# EAGLE design BMS_Slave_v2 (EAGLE 6.4)
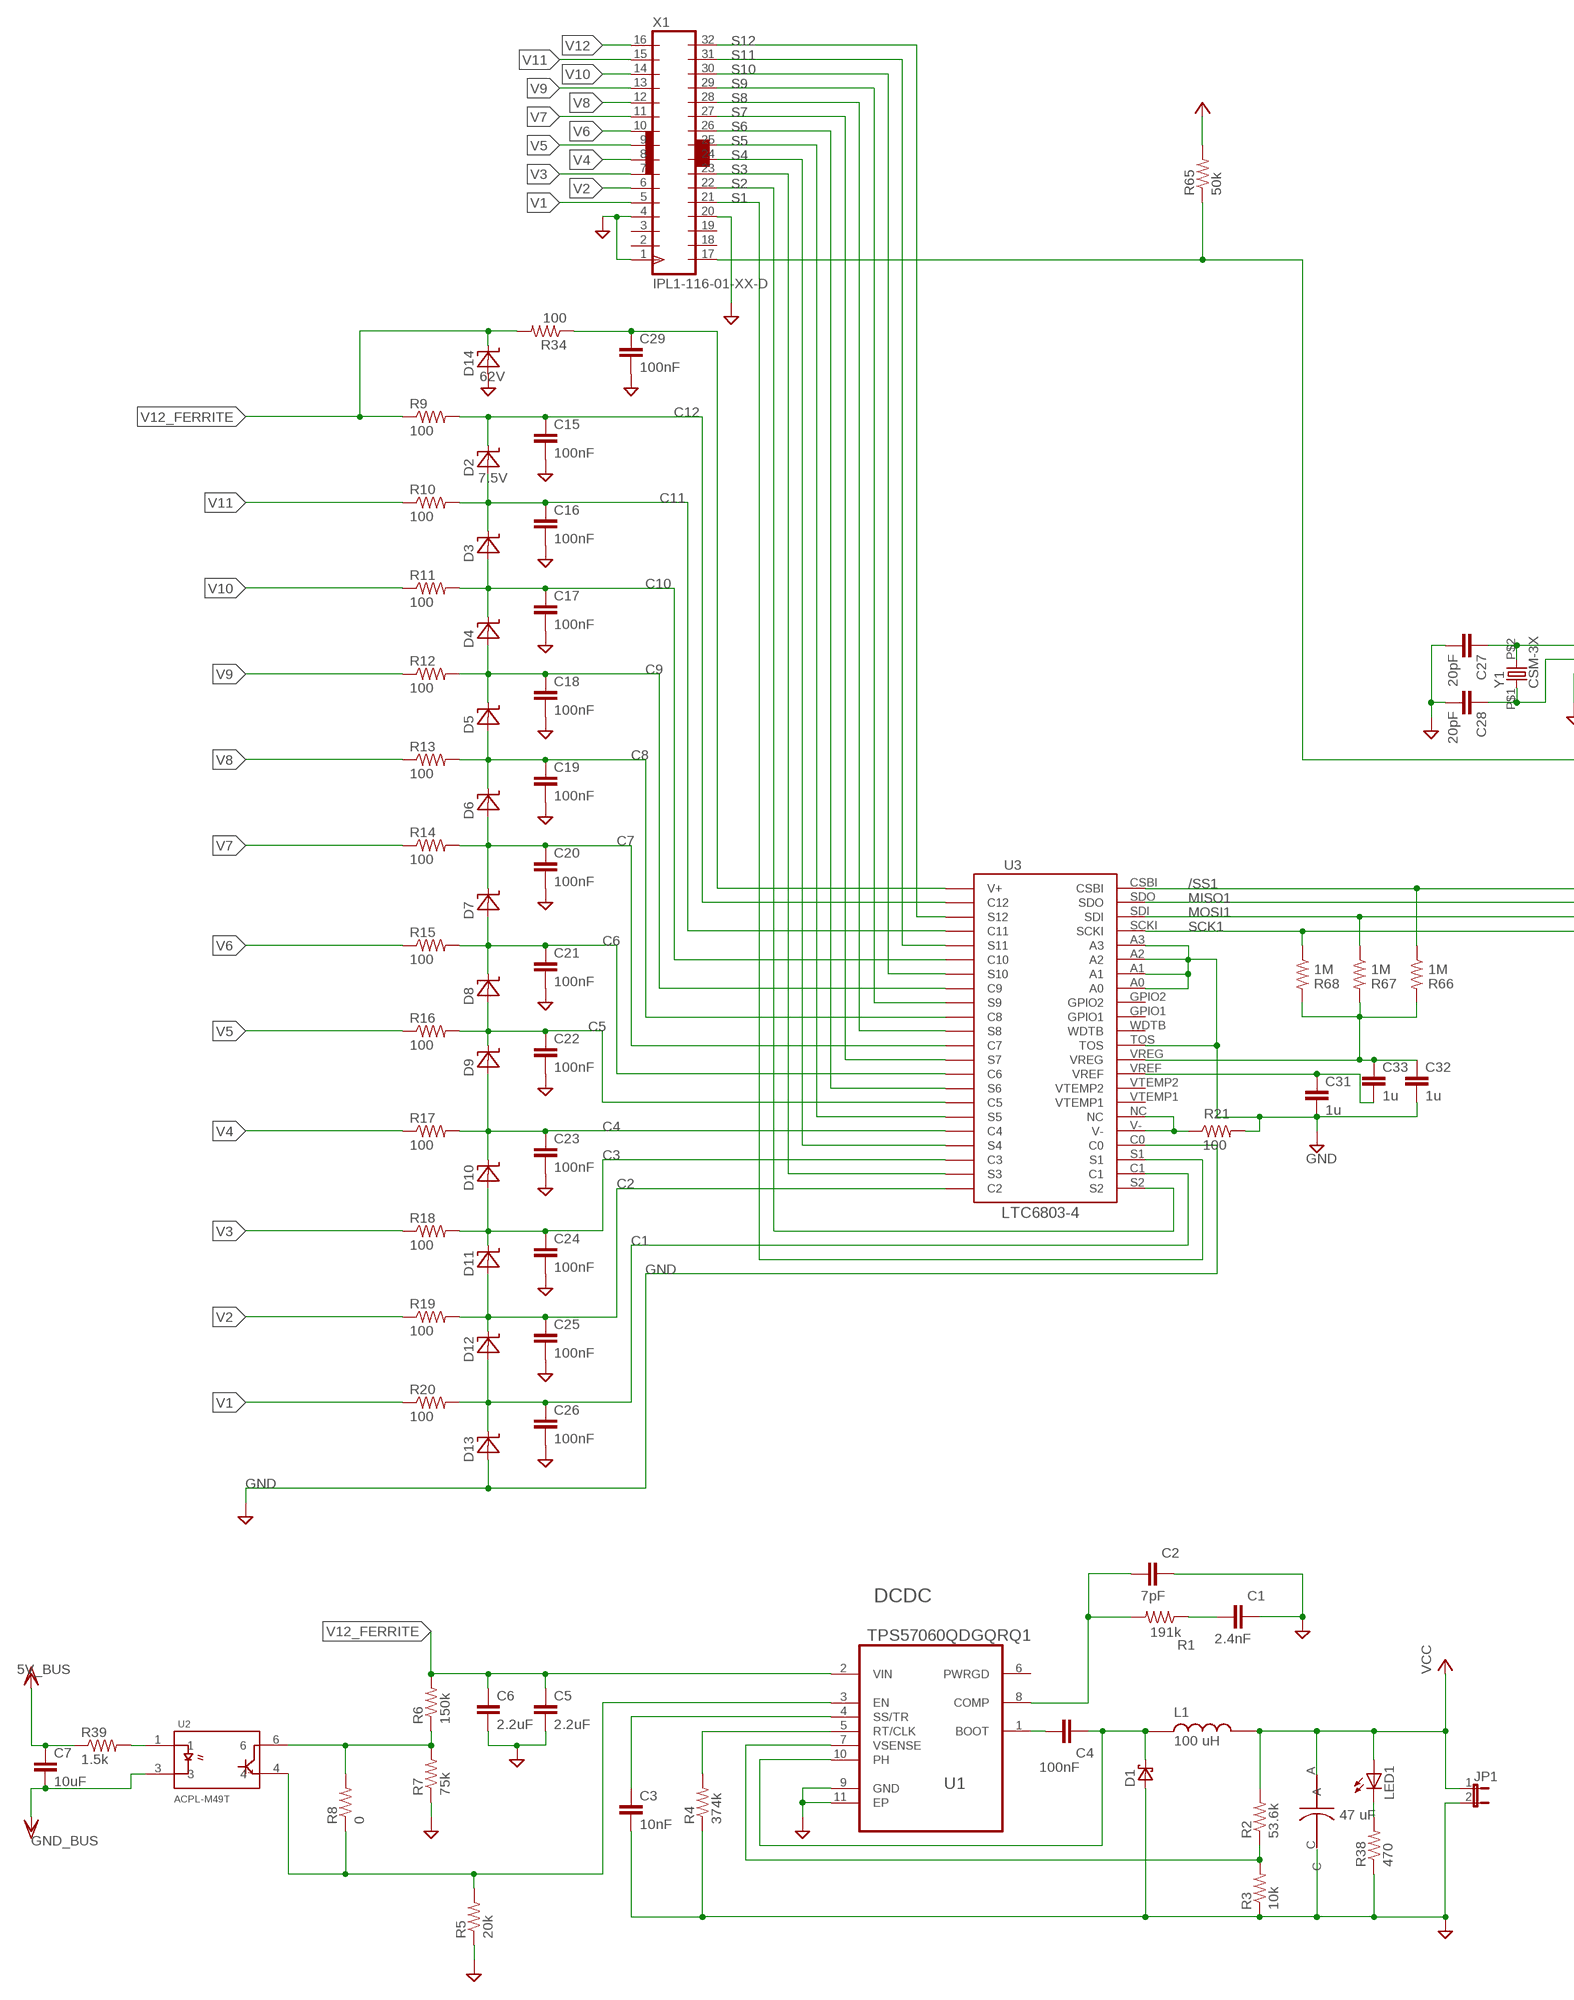
[diagram p0: schematic, sheet 1, part 1 of 2]
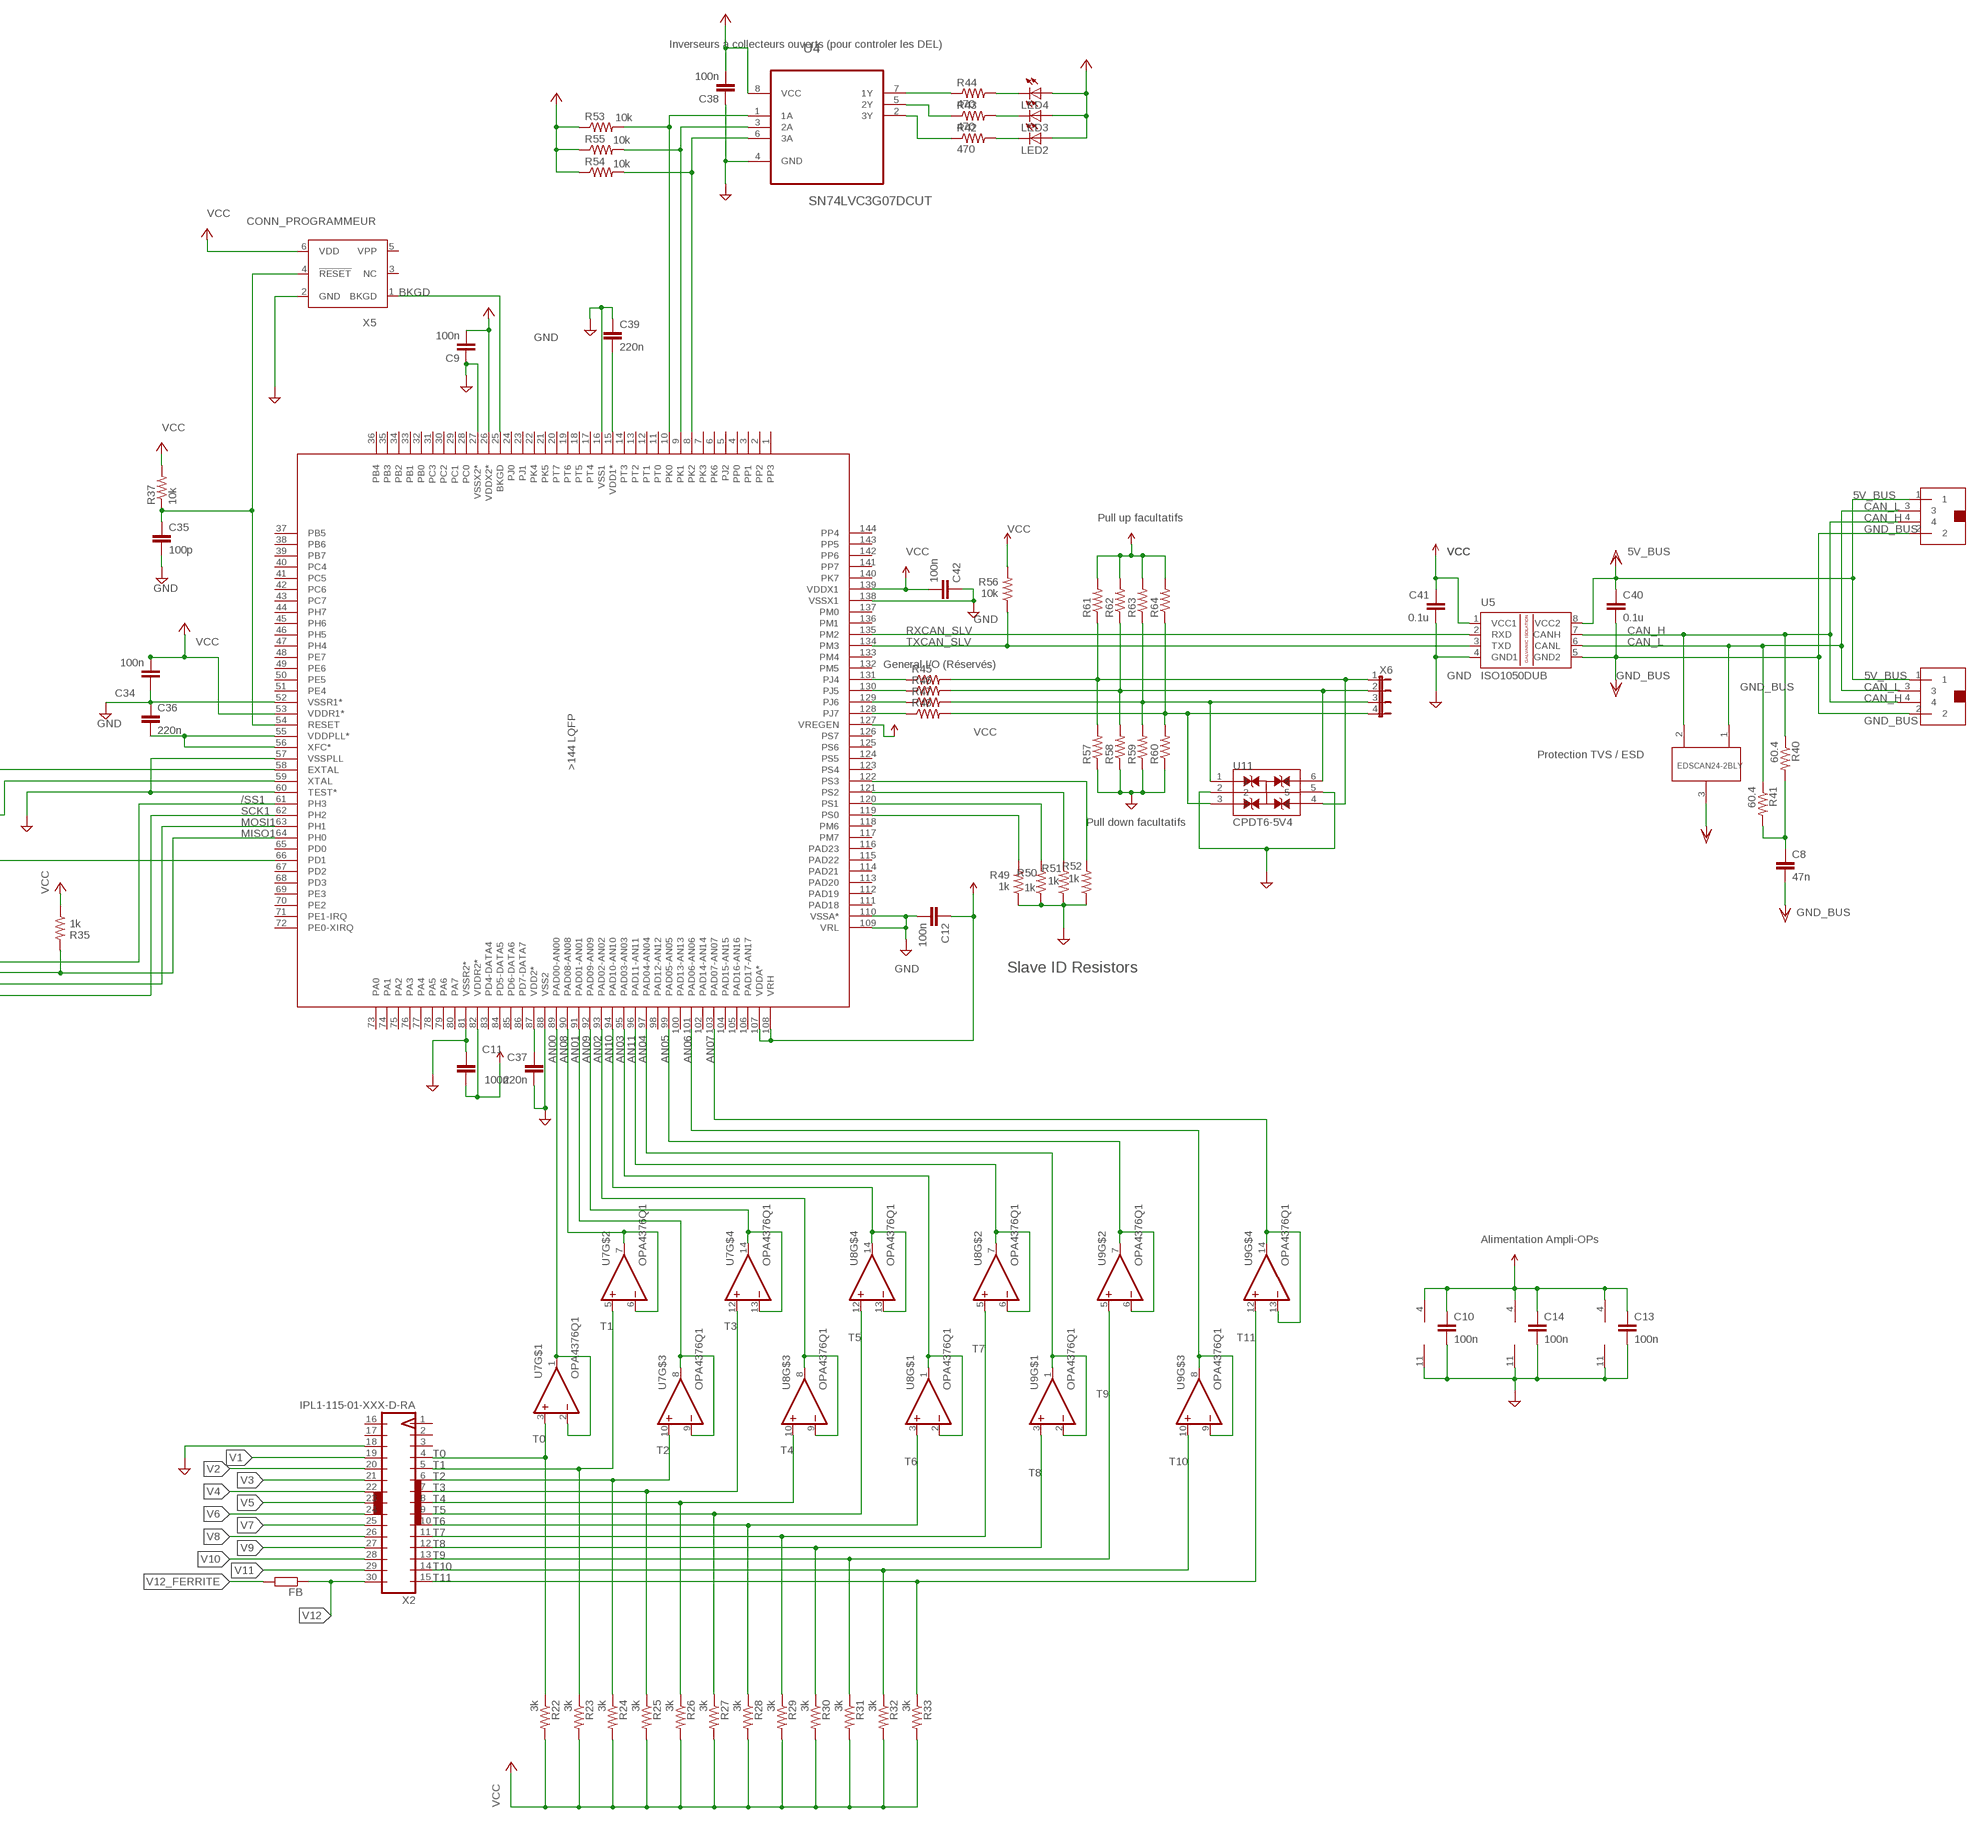
[diagram p1: schematic, sheet 1, part 2 of 2]

## Parts
C1  2.4nF  CC0603  [C0603]
C2  7pF  CC0603  [C0603]
C3  10nF  CC0603  [C0603]
C4  100nF  CC0603  [C0603]
C5  2.2uF  C-EUC3225  [C3225]
C6  2.2uF  C-EUC3225  [C3225]
C7  10uF  CC0603  [C0603]
C8  47n  C-EUC0603  [C0603]
C9  100n  C-EUC0603  [C0603]
C10  100n  C-EUC0603  [C0603]
C11  100n  CC0603  [C0603]
C12  100n  C-EUC0603  [C0603]
C13  100n  C-EUC0603  [C0603]
C14  100n  C-EUC0603  [C0603]
C15  100nF  CC0603  [C0603]
C16  100nF  CC0603  [C0603]
C17  100nF  CC0603  [C0603]
C18  100nF  CC0603  [C0603]
C19  100nF  CC0603  [C0603]
C20  100nF  CC0603  [C0603]
C21  100nF  CC0603  [C0603]
C22  100nF  CC0603  [C0603]
C23  100nF  CC0603  [C0603]
C24  100nF  CC0603  [C0603]
C25  100nF  CC0603  [C0603]
C26  100nF  CC0603  [C0603]
C27  20pF  C-EUC0603  [C0603]
C28  20pF  C-EUC0603  [C0603]
C29  100nF  CC0603  [C0603]
C31  1u  CC0603  [C0603]
C32  1u  CC0603  [C0603]
C33  1u  CC0603  [C0603]
C34  100n  CC0603  [C0603]
C35  100p  CC0603  [C0603]
C36  220n  CC0603  [C0603]
C37  220n  C-EUC0603  [C0603]
C38  100n  C-EUC0603  [C0603]
C39  220n  C-EUC0603  [C0603]
C40  0.1u  C-EUC0603  [C0603]
C41  0.1u  C-EUC0603  [C0603]
C42  100n  C-EUC0603  [C0603]
C43  47 uF  APXE_47_COND  [APXE_CONDENSATEUR]
D1  BYS12-90GENERIC  [DO214AC_ZENER]
D2  DIODE_ZENER  [SOD123]
D3  DIODE_ZENER  [SOD123]
D4  DIODE_ZENER  [SOD123]
D5  DIODE_ZENER  [SOD123]
D6  DIODE_ZENER  [SOD123]
D7  DIODE_ZENER  [SOD123]
D8  DIODE_ZENER  [SOD123]
D9  DIODE_ZENER  [SOD123]
D10  DIODE_ZENER  [SOD123]
D11  DIODE_ZENER  [SOD123]
D12  DIODE_ZENER  [SOD123]
D13  DIODE_ZENER  [SOD123]
D14  DIODE_ZENER  [SOD123]
FB  R-EU_R0805  [R0805]
JP1  JP1E  [JP1]
L1  100 uH  VLP8040T-101M  [VLP8040T-101M]
LED1  LED  [1206_LED]
LED2  LED  [1206_LED]
LED3  LED  [1206_LED]
LED4  LED  [1206_LED]
R1  191k  R-US_R0603  [R0603]
R2  53.6k  R-US_R0603  [R0603]
R3  10k  R-US_R0603  [R0603]
R4  374k  R-US_R0603  [R0603]
R5  20k  R-US_R0603  [R0603]
R6  150k  R-US_R0603  [R0603]
R7  75k  R-US_R0603  [R0603]
R8  0  R-US_R0603  [R0603]
R9  100  R-US_R0603  [R0603]
R10  100  R-US_R0603  [R0603]
R11  100  R-US_R0603  [R0603]
R12  100  R-US_R0603  [R0603]
R13  100  R-US_R0603  [R0603]
R14  100  R-US_R0603  [R0603]
R15  100  R-US_R0603  [R0603]
R16  100  R-US_R0603  [R0603]
R17  100  R-US_R0603  [R0603]
R18  100  R-US_R0603  [R0603]
R19  100  R-US_R0603  [R0603]
R20  100  R-US_R0603  [R0603]
R21  100  R-US_R0603  [R0603]
R22  3k  R-US_R0603  [R0603]
R23  3k  R-US_R0603  [R0603]
R24  3k  R-US_R0603  [R0603]
R25  3k  R-US_R0603  [R0603]
R26  3k  R-US_R0603  [R0603]
R27  3k  R-US_R0603  [R0603]
R28  3k  R-US_R0603  [R0603]
R29  3k  R-US_R0603  [R0603]
R30  3k  R-US_R0603  [R0603]
R31  3k  R-US_R0603  [R0603]
R32  3k  R-US_R0603  [R0603]
R33  3k  R-US_R0603  [R0603]
R34  100  R-US_R0603  [R0603]
R35  1k  R-US_R0603  [R0603]
R37  10k  R-US_R0603  [R0603]
R38  470  R-US_R0603  [R0603]
R39  1.5k  R-US_R0603  [R0603]
R40  60.4  R-US_R0603  [R0603]
R41  60.4  R-US_R0603  [R0603]
R42  470  R-US_R0603  [R0603]
R43  470  R-US_R0603  [R0603]
R44  470  R-US_R0603  [R0603]
R45  R-US_R0603  [R0603]
R46  R-US_R0603  [R0603]
R47  R-US_R0603  [R0603]
R48  R-US_R0603  [R0603]
R49  1k  R-US_R0603  [R0603]
R50  1k  R-US_R0603  [R0603]
R51  1k  R-US_R0603  [R0603]
R52  1k  R-US_R0603  [R0603]
R53  10k  R-US_R0603  [R0603]
R54  10k  R-US_R0603  [R0603]
R55  10k  R-US_R0603  [R0603]
R56  10k  R-US_R0603  [R0603]
R57  R-US_R0603  [R0603]
R58  R-US_R0603  [R0603]
R59  R-US_R0603  [R0603]
R60  R-US_R0603  [R0603]
R61  R-US_R0603  [R0603]
R62  R-US_R0603  [R0603]
R63  R-US_R0603  [R0603]
R64  R-US_R0603  [R0603]
R65  50k  R-US_R0603  [R0603]
R66  1M  R-US_R0603  [R0603]
R67  1M  R-US_R0603  [R0603]
R68  1M  R-US_R0603  [R0603]
U1  TPS57060QDGQRQ1  TPS54060QDGQRQ1  [SOP50P490X110-11N]
U2  ACPL-M49T  [SO5]
U3  LTC6803-4  [LTC6803-4]
U4  SN74LVC3G07DCUT  [SOP50P310X90-8N]
U5  ISO1050DUB  [DUB-R-PDSO-G8]
U6  MC9S12XD-144  [SQFP-S-20X20-144]
U7  OPA4376Q1  [TSSOP-14]
U8  OPA4376Q1  [TSSOP-14]
U9  OPA4376Q1  [TSSOP-14]
U10  EDSCAN24-2BLY  [SOT23-3]
U11  CPDT6-5V4  [SOT23-6]
X1  IPL1-116-01-XX-D  [IPL1-116-01-XX-D]
X2  IPL1-115-01-XXX-D-RA  [IPL1-115-01-XXX-D-RA]
X3  IPL1-102-01-XXX-D-RA  [IPL1-102-01-XXX-D-RA]
X4  IPL1-102-01-XXX-D-RA  [IPL1-102-01-XXX-D-RA]
X5  CONN_PROGRAMMEUR  [CONNECTEUR_PROGRAMMEUR]
X6  JP4E  [JP4]
Y1  CSM-3X  [CSM-3X]

## Nets
1: C2.1 R1.2 U1.8(COMP)
5V_BUS: C7.1 C40.1 R39.1 U5.8(VCC2) X3.1 X4.1
/SS1: R66.1 U3.CSBI U6.61(PH3)
AN00: U6.89(PAD00-AN00) U7.1(OUT) U7.2(-IN)
AN01: U6.91(PAD01-AN01) U7.8(OUT) U7.9(-IN)
AN02: U6.93(PAD02-AN02) U8.8(OUT) U8.9(-IN)
AN03: U6.95(PAD03-AN03) U8.1(OUT) U8.2(-IN)
AN04: U6.97(PAD04-AN04) U9.1(OUT) U9.2(-IN)
AN05: U6.99(PAD05-AN05) U9.6(-IN) U9.7(OUT)
AN06: U6.101(PAD06-AN06) U9.8(OUT) U9.9(-IN)
AN07: U6.103(PAD07-AN07) U9.13(-IN) U9.14(OUT)
AN08: U6.90(PAD08-AN08) U7.6(-IN) U7.7(OUT)
AN09: U6.92(PAD09-AN09) U7.13(-IN) U7.14(OUT)
AN10: U6.94(PAD10-AN10) U8.13(-IN) U8.14(OUT)
AN11: U6.96(PAD11-AN11) U8.6(-IN) U8.7(OUT)
BKGD: U6.25(BKGD) X5.1(BKGD)
C1: C26.1 D12.A D13.C R20.2 U3.C1
C2: C25.1 D11.A D12.C R19.2 U3.C2
C3: C24.1 D10.A D11.C R18.2 U3.C3
C4: C23.1 D9.A D10.C R17.2 U3.C4
C5: C22.1 D8.A D9.C R16.2 U3.C5
C6: C21.1 D7.A D8.C R15.2 U3.C6
C7: C20.1 D6.A D7.C R14.2 U3.C7
C8: C19.1 D5.A D6.C R13.2 U3.C8
C9: C18.1 D4.A D5.C R12.2 U3.C9
C10: C17.1 D3.A D4.C R11.2 U3.C10
C11: C16.1 D2.A D3.C R10.2 U3.C11
C12: C15.1 D2.C R9.2 U3.C12
C44: C4.2 D1.C L1.P$2 U1.10(PH)
CAN_H: R40.1 U5.7(CANH) U10.2 X3.4 X4.4
CAN_L: R41.1 U5.6(CANL) U10.1 X3.3 X4.3
CSS: C3.1 U1.4(SS/TR)
EXTAL: C27.1 U6.58(EXTAL) Y1.P$2
GND [GND plain]: C1.2 C2.2 C3.2 C5.2 C6.2 C9.1 C10.2 C11.1 C12.2 C13.2 C14.2 C15.2 C16.2 C17.2 C18.2 C19.2 C20.2 C21.2 C22.2 C23.2 C24.2 C25.2 C26.2 C27.2 C28.2 C29.2 C31.2 C32.2 C34.1 C35.2 C36.1 C37.2 C38.1 C39.1 C41.2 C42.1 C43.C D1.A D13.A D14.A JP1.2 R3.1 R4.1 R5.1 R7.1 R21.2 R38.1 R49.1 R50.1 R51.1 R52.1 R57.1 R58.1 R59.1 R60.1 U1.9(GND) U1.11(EP) U3.A0 U3.A1 U3.A2 U3.A3 U3.C0 U3.TOS U4.4(GND) U5.4(GND1) U6.16(VSS1) U6.27(VSSX2*) U6.52(VSSR1*) U6.57(VSSPLL) U6.60(TEST*) U6.81(VSSR2*) U6.88(VSS2) U6.109(VRL) U6.110(VSSA*) U6.138(VSSX1) U7.11(V-) U8.11(V-) U9.11(V-) U11.2 U11.5 X1.1 X1.4 X1.20 X2.18 X5.2(GND) ; supply symbol labelled GND_SLV
GND_BUS [GND plain]: C7.2 C8.2 C40.2 U2.3 U5.5(GND2) U10.3 X3.2 X4.2
MISO1: R35.2 U3.SDO U6.64(PH0)
MOSI1: R67.1 U3.SDI U6.63(PH1)
N$1: C29.1 R34.1 U3.V+
N$2: R39.2 U2.1
N$3: C37.1 U6.87(VDD2*)
N$4: C31.1 C33.2 U3.VREF
N$5: C32.1 C33.1 R66.2 R67.2 R68.2 U3.VREG
N$6 [GND plain]: R21.1 U3.NC U3.V-
N$7: C36.2 U6.55(VDDPLL*) U6.56(XFC*)
N$11: R42.1 U4.2(3Y)
N$16: R49.2 U6.119(PS0)
N$17: R50.2 U6.120(PS1)
N$19: R51.2 U6.121(PS2)
N$20: R52.2 U6.122(PS3)
N$23: LED2.C R42.2
N$25: LED3.C R43.2
N$26: LED4.C R44.2
N$27: R44.1 U4.7(1Y)
N$28: R43.1 U4.5(2Y)
N$30: R65.1 U6.66(PD1) X1.17
N$31: R45.1 U6.131(PJ4)
N$32: C8.1 R40.2 R41.2
N$33: R46.1 U6.130(PJ5)
N$34: R54.2 U4.6(3A) U6.8(PK2)
N$35: R55.2 U4.3(2A) U6.9(PK1)
N$40: R53.2 U4.1(1A) U6.10(PK0)
N$42: C4.1 U1.1(BOOT)
N$43: R4.2 U1.5(RT/CLK)
N$44: R47.1 U6.129(PJ6)
N$45: R2.1 R3.2 U1.7(VSENSE)
N$47: LED1.C R38.2
N$48: R48.1 U6.128(PJ7)
N$49: R5.2 R8.1 U1.3(EN) U2.4
N$50: R6.1 R7.2 R8.2 U2.6
N$51: R45.2 R57.2 R61.1 U11.4 X6.1
N$52: R46.2 R58.2 R62.1 U11.6 X6.2
N$53: R47.2 R59.2 R63.1 U11.1 X6.3
N$54: R48.2 R60.2 R64.1 U11.3 X6.4
R59: C1.1 R1.1
RST: C35.1 R37.1 U6.54(RESET) X5.4(!RESET)
RXCAN_SLV: U5.2(RXD) U6.135(PM2)
S1: U3.S1 X1.21
S2: U3.S2 X1.22
S3: U3.S3 X1.23
S4: U3.S4 X1.24
S5: U3.S5 X1.25
S6: U3.S6 X1.26
S7: U3.S7 X1.27
S8: U3.S8 X1.28
S9: U3.S9 X1.29
S10: U3.S10 X1.30
S11: U3.S11 X1.31
S12: U3.S12 X1.32
SCK1: R68.1 U3.SCKI U6.62(PH2)
T0: R22.1 U7.3(+IN) X2.4
T1: R23.1 U7.5(+IN) X2.5
T2: R24.1 U7.10(+IN) X2.6
T3: R25.1 U7.12(+IN) X2.7
T4: R26.1 U8.10(+IN) X2.8
T5: R27.1 U8.12(+IN) X2.9
T6: R28.1 U8.3(+IN) X2.10
T7: R29.1 U8.5(+IN) X2.11
T8: R30.1 U9.3(+IN) X2.12
T9: R31.1 U9.5(+IN) X2.13
T10: R32.1 U9.10(+IN) X2.14
T11: R33.1 U9.12(+IN) X2.15
TXCAN_SLV: R56.1 U5.3(TXD) U6.134(PM3)
V1: R20.1 X1.5 X2.19
V2: R19.1 X1.6 X2.20
V3: R18.1 X1.7 X2.21
V4: R17.1 X1.8 X2.22
V5: R16.1 X1.9 X2.23
V6: R15.1 X1.10 X2.24
V7: R14.1 X1.11 X2.25
V8: R13.1 X1.12 X2.26
V9: R12.1 X1.13 X2.27
V10: R11.1 X1.14 X2.28
V11: R10.1 X1.15 X2.29
V12: FB.1 X1.16 X2.30
V12_FERRITE: C5.1 C6.1 D14.C FB.2 R6.2 R9.1 R34.2 U1.2(VIN)
VCC: C9.2 C10.1 C11.2 C12.1 C13.1 C14.1 C34.2 C38.2 C41.1 C42.2 C43.A JP1.1 L1.P$1 LED1.A LED2.A LED3.A LED4.A R2.2 R22.2 R23.2 R24.2 R25.2 R26.2 R27.2 R28.2 R29.2 R30.2 R31.2 R32.2 R33.2 R35.1 R37.2 R53.1 R54.1 R55.1 R56.2 R61.2 R62.2 R63.2 R64.2 R65.2 U4.8(VCC) U5.1(VCC1) U6.26(VDDX2*) U6.53(VDDR1*) U6.82(VDDR2*) U6.107(VDDA*) U6.108(VRH) U6.127(VREGEN) U6.139(VDDX1) U7.4(V+) U8.4(V+) U9.4(V+) X5.6(VDD)
VDD1: C39.2 U6.15(VDD1*)
XTAL: C28.1 U6.59(XTAL) Y1.P$1
Unconnected: U1.6(PWRGD) U3.GPIO1 U3.GPIO2 U3.VTEMP1 U3.VTEMP2 U3.WDTB U6.1(PP3) U6.2(PP2) U6.3(PP1) U6.4(PP0) U6.5(PJ2) U6.6(PK6) U6.7(PK3) U6.11(PT0) U6.12(PT1) U6.13(PT2) U6.14(PT3) U6.17(PT4) U6.18(PT5) U6.19(PT6) U6.20(PT7) U6.21(PK5) U6.22(PK4) U6.23(PJ1) U6.24(PJ0) U6.28(PC0) U6.29(PC1) U6.30(PC2) U6.31(PC3) U6.32(PB0) U6.33(PB1) U6.34(PB2) U6.35(PB3) U6.36(PB4) U6.37(PB5) U6.38(PB6) U6.39(PB7) U6.40(PC4) U6.41(PC5) U6.42(PC6) U6.43(PC7) U6.44(PH7) U6.45(PH6) U6.46(PH5) U6.47(PH4) U6.48(PE7) U6.49(PE6) U6.50(PE5) U6.51(PE4) U6.65(PD0) U6.67(PD2) U6.68(PD3) U6.69(PE3) U6.70(PE2) U6.71(PE1-IRQ) U6.72(PE0-XIRQ) U6.73(PA0) U6.74(PA1) U6.75(PA2) U6.76(PA3) U6.77(PA4) U6.78(PA5) U6.79(PA6) U6.80(PA7) U6.83(PD4-DATA4) U6.84(PD5-DATA5) U6.85(PD6-DATA6) U6.86(PD7-DATA7) U6.98(PAD12-AN12) U6.100(PAD13-AN13) U6.102(PAD14-AN14) U6.104(PAD15-AN15) U6.105(PAD16-AN16) U6.106(PAD17-AN17) U6.111(PAD18) U6.112(PAD19) U6.113(PAD20) U6.114(PAD21) U6.115(PAD22) U6.116(PAD23) U6.117(PM7) U6.118(PM6) U6.123(PS4) U6.124(PS5) U6.125(PS6) U6.126(PS7) U6.132(PM5) U6.133(PM4) U6.136(PM1) U6.137(PM0) U6.140(PK7) U6.141(PP7) U6.142(PP6) U6.143(PP5) U6.144(PP4) X1.2 X1.3 X1.18 X1.19 X2.1 X2.2 X2.3 X2.16 X2.17 X5.3(NC) X5.5(VPP)

## Notes on the sheet
- Inverseurs à collecteurs ouverts (pour controler les DEL)
- Pull up facultatifs
- 62V
- 7.5V
- General I/O (Réservés)
- Protection TVS / ESD
- Pull down facultatifs
- Slave ID Resistors
- Alimentation Ampli-OPs
- DCDC

## Library data of the parts
C1-C4 C7 C11 C15-C26 C29 C31-C36 = eagle-ltspice:C: CAPACITOR, European symbol; SPICEMODEL: NONE; SPICEPREFIX: C
C5 C6 = resistor:C-EU: CAPACITOR, European symbol
C8-C10 C12-C14 C27 C28 C37-C42 = rcl:C-EU: CAPACITOR, European symbol
C43 = BMS_Slave_v2:APXE_47_COND
D1 = BMS_Slave_v2:BYS12-90
D2-D14 = BMS_Slave_v2:DIODE_ZENER
FB = rcl:R-EU_: RESISTOR, European symbol
JP1 = jumper:JP1E: JUMPER
L1 = BMS_Slave_v2:VLP8040T-101M
LED1 = BMS_Slave_v2:LED
LED2-LED4 = ELE4000_BMS:LED
R1-R21 R34 R35 R37 R39 R42-R44 R49-R56 R65-R68 = resistor:R-US_: RESISTOR, American symbol
R22-R33 R38 R40 R41 R45-R48 R57-R64 = rcl:R-US_: RESISTOR, American symbol
U1 = texas-extend:TPS54060QDGQRQ1: 0.5-A 60-V STEP-DOWN SWIFT DC/DC CONVERTER WITH Eco-mode; MPN: TPS54060QDGQRQ1; OC_FARNELL: -; OC_NEWARK: 55R7580; PACKAGE: MSOP-10; SUPPLIER: Texas Instruments
U2 = BMS_Slave_v2:ACPL-M49T
U3 = BMS_Slave_v2:LTC6803-4
U4 = texas-extend:SN74LVC3G07DCUT: TRIPLE BUFFER/DRIVER WITH OPEN-DRAIN OUTPUTS; MPN: SN74LVC3G07DCUT; OC_FARNELL: 1741029; OC_NEWARK: 34R8950; PACKAGE: SOP-8; SUPPLIER: Texas Instruments
U5 = texas:ISO1050: ISOLATED CAN TRANSCEIVER Source: http://focus.ti.com/lit/ds/symlink/iso1050.pdf; MPN: ISO1050DUBR; OC_FARNELL: 1755712; OC_NEWARK: 14R9899
U6 = BMS_Slave_v2:MC9S12XD-144: MC9S12XF512 Source: www.freescale.com .. MC9S12XF512V1RM.pdf; MPN: LFDAS12XFLT; OC_FARNELL: unknown; OC_NEWARK: 14M5920
U7-U9 = BMS_Slave_v2:OPA4376Q1
U10 = BMS_Slave_v2:EDSCAN24-2BLY
U11 = BMS_Slave_v2:CPDT6-5V4
X1 = BMS_Slave_v2:IPL1-116-01-XX-D
X2 = BMS_Slave_v2:IPL1-115-01-XXX-D-RA
X3 X4 = BMS_Slave_v2:IPL1-102-01-XXX-D-RA: 0.100" DOUBLE ROW TERMINAL ASSEMBLY. MANUFACTURER: SAMTEC.
X5 = BMS_Slave_v2:CONN_PROGRAMMEUR
X6 = jumper:JP4E: JUMPER
Y1 = BMS_Slave_v2:CSM-3X

## Net classes
0 default: clearance 0.203 mm
1 No_trace: clearance 0.2 mm
2 GND plain: clearance 0.406 mm

## Board
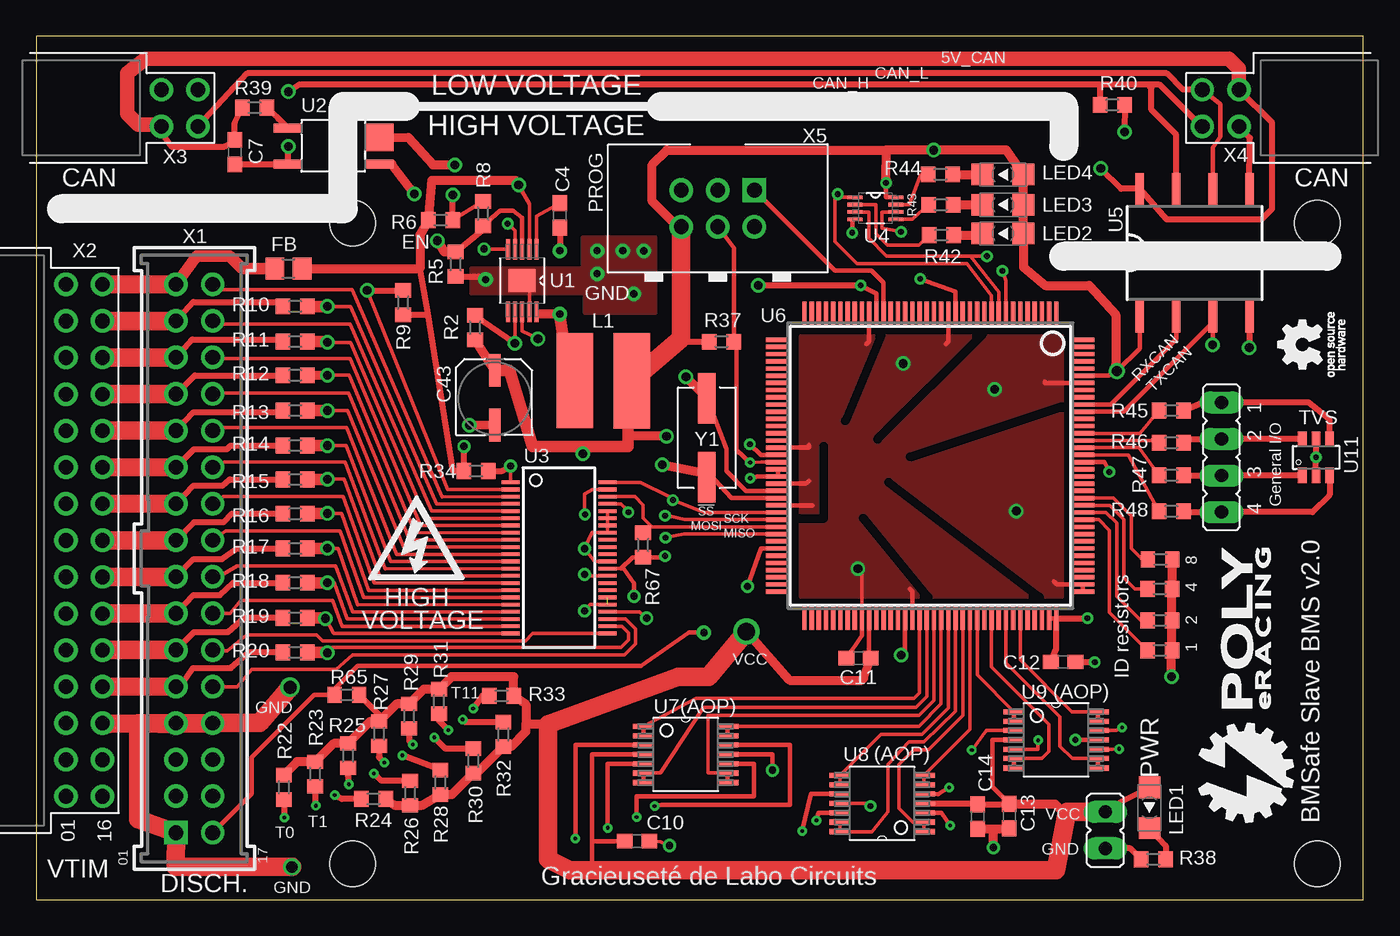
[diagram p2: board, top side]
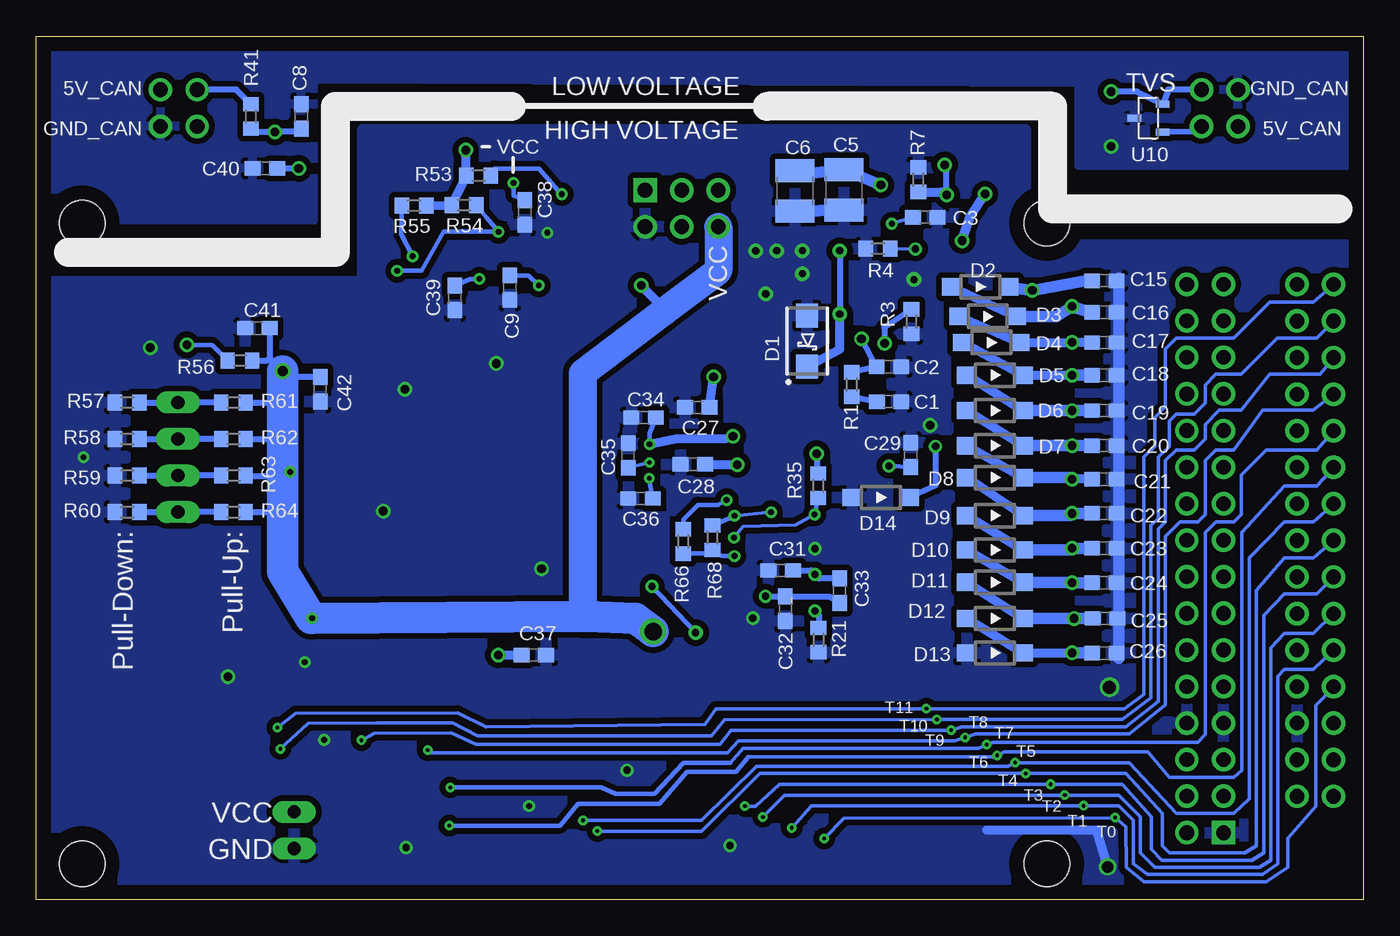
[diagram p3: board, bottom side, seen from below]

Size 92.2 x 60 mm. Coordinates in mm from the lower left corner, seen from the top.
Outline: 0,0 92.2,0 92.2,60 0,60 0,0
Copper layers (1*16): Top 0.035mm / dielectric 1.5mm / Bottom 0.035mm
Design rules "default *": minimum track width 5mil, minimum drill 8mil, track to track 5mil, track to pad 5mil, pad to pad 5mil, via to via 8mil, smd to smd 5mil, copper to edge 40mil, drill to drill 8mil, minimum pad ring 12mil, minimum via ring 8mil, stop-mask expansion 4mil, vias tented up to drill 0mil, thermal gap 10mil
Holes 3.15 mm at 22,47 89,47 89,2.5 22,2.5
tRestrict: 7 lines

### Footprints (pad centres in the part's own frame; a part is rotated, then mirrored left to right if it is on the bottom)
C0603 = smd 1.1 x 1: 1 -0.85,0; 2 0.85,0
C3225 = smd 1.6 x 2.7: 1 -1.4,0; 2 1.4,0
APXE_CONDENSATEUR = smd 0.8 x 2.27: A 0,4.5; C 0,0.7
DO214AC_ZENER = smd 1.68 x 1.52: A 1.77,0; C -1.77,0
SOD123 = smd 1.4 x 1.2: A 1.95,0; C -1.95,0
R0805 = smd 1.3 x 1.5: 1 -0.95,0; 2 0.95,0
JP1 = drill 0.914 long: 1 0,-1.27; 2 0,1.27
VLP8040T-101M = smd 2.55 x 6.6: P$1 -1.96,-0.12; P$2 1.99,-0.13
1206_LED = smd 1.5 x 1.5: A -1.422,0; C 1.422,0
R0603 = smd 1 x 1.1: 1 -0.85,0; 2 0.85,0
SOP50P490X110-11N = smd 1.422 x 0.279: 1 -2.184,0.991; 2 -2.184,0.508; 3 -2.184,0; 4 -2.184,-0.508; 5 -2.184,-0.991; 6 2.184,-0.991; 7 2.184,-0.508; 8 2.184,0; 9 2.184,0.508; 10 2.184,0.991 | smd 1.575 x 1.88: 11 0,0
SO5 = smd 2 x 0.64: 1 -3.14,1.42; 3 -3.14,-1.08; 4 3.175,-1.08 | smd 2 x 1.92: 6 3.18,0.78
LTC6803-4 = smd 1.25 x 0.25: A0 3.375,1.75; A1 3.375,2.25; A2 3.375,2.75; A3 3.375,3.25; C0 3.375,-3.75; C1 3.375,-4.75; C2 -3.375,-5.25; C3 -3.375,-4.25; C4 -3.375,-3.25; C5 -3.375,-2.25; C6 -3.375,-1.25; C7 -3.375,-0.25; C8 -3.375,0.75; C9 -3.375,1.75; C10 -3.375,2.75; C11 -3.375,3.75; C12 -3.375,4.75; CSBI 3.375,5.25; GPIO1 3.375,0.75; GPIO2 3.375,1.25; NC 3.375,-2.75; S1 3.375,-4.25; S2 3.375,-5.25; S3 -3.375,-4.75; S4 -3.375,-3.75; S5 -3.375,-2.75; S6 -3.375,-1.75; S7 -3.375,-0.75; S8 -3.375,0.25; S9 -3.375,1.25; S10 -3.375,2.25; S11 -3.375,3.25; S12 -3.375,4.25; SCKI 3.375,3.75; SDI 3.375,4.25; SDO 3.375,4.75; TOS 3.375,-0.25; V+ -3.375,5.25; V- 3.375,-3.25; VREF 3.375,-1.25; VREG 3.375,-0.75; VTEMP1 3.375,-2.25; VTEMP2 3.375,-1.75; WDTB 3.375,0.25
SOP50P310X90-8N = smd 1.067 x 0.254: 1 -1.422,0.762; 2 -1.422,0.254; 3 -1.422,-0.254; 4 -1.422,-0.762; 5 1.422,-0.762; 6 1.422,-0.254; 7 1.422,0.254; 8 1.422,0.762
DUB-R-PDSO-G8 = smd 0.6 x 2.2: 1 -3.81,-4.445; 2 -1.27,-4.445; 3 1.27,-4.445; 4 3.81,-4.445; 5 3.81,4.445; 6 1.27,4.445; 7 -1.27,4.445; 8 -3.81,4.445
SQFP-S-20X20-144 = smd 0.3 x 1.6: 1 -8.75,-10.6; 2 -8.25,-10.6; 3 -7.75,-10.6; 4 -7.25,-10.6; 5 -6.75,-10.6; 6 -6.25,-10.6; 7 -5.75,-10.6; 8 -5.25,-10.6; 9 -4.75,-10.6; 10 -4.25,-10.6; 11 -3.75,-10.6; 12 -3.25,-10.6; 13 -2.75,-10.6; 14 -2.25,-10.6; 15 -1.75,-10.6; 16 -1.25,-10.6; 17 -0.75,-10.6; 18 -0.25,-10.6; 19 0.25,-10.6; 20 0.75,-10.6; 21 1.25,-10.6; 22 1.75,-10.6; 23 2.25,-10.6; 24 2.75,-10.6; 25 3.25,-10.6; 26 3.75,-10.6; 27 4.25,-10.6; 28 4.75,-10.6; 29 5.25,-10.6; 30 5.75,-10.6; 31 6.25,-10.6; 32 6.75,-10.6; 33 7.25,-10.6; 34 7.75,-10.6; 35 8.25,-10.6; 36 8.75,-10.6; 73 8.75,10.6; 74 8.25,10.6; 75 7.75,10.6; 76 7.25,10.6; 77 6.75,10.6; 78 6.25,10.6; 79 5.75,10.6; 80 5.25,10.6; 81 4.75,10.6; 82 4.25,10.6; 83 3.75,10.6; 84 3.25,10.6; 85 2.75,10.6; 86 2.25,10.6; 87 1.75,10.6; 88 1.25,10.6; 89 0.75,10.6; 90 0.25,10.6; 91 -0.25,10.6; 92 -0.75,10.6; 93 -1.25,10.6; 94 -1.75,10.6; 95 -2.25,10.6; 96 -2.75,10.6; 97 -3.25,10.6; 98 -3.75,10.6; 99 -4.25,10.6; 100 -4.75,10.6; 101 -5.25,10.6; 102 -5.75,10.6; 103 -6.25,10.6; 104 -6.75,10.6; 105 -7.25,10.6; 106 -7.75,10.6; 107 -8.25,10.6; 108 -8.75,10.6 | smd 1.6 x 0.3: 37 10.6,-8.75; 38 10.6,-8.25; 39 10.6,-7.75; 40 10.6,-7.25; 41 10.6,-6.75; 42 10.6,-6.25; 43 10.6,-5.75; 44 10.6,-5.25; 45 10.6,-4.75; 46 10.6,-4.25; 47 10.6,-3.75; 48 10.6,-3.25; 49 10.6,-2.75; 50 10.6,-2.25; 51 10.6,-1.75; 52 10.6,-1.25; 53 10.6,-0.75; 54 10.6,-0.25; 55 10.6,0.25; 56 10.6,0.75; 57 10.6,1.25; 58 10.6,1.75; 59 10.6,2.25; 60 10.6,2.75; 61 10.6,3.25; 62 10.6,3.75; 63 10.6,4.25; 64 10.6,4.75; 65 10.6,5.25; 66 10.6,5.75; 67 10.6,6.25; 68 10.6,6.75; 69 10.6,7.25; 70 10.6,7.75; 71 10.6,8.25; 72 10.6,8.75; 109 -10.6,8.75; 110 -10.6,8.25; 111 -10.6,7.75; 112 -10.6,7.25; 113 -10.6,6.75; 114 -10.6,6.25; 115 -10.6,5.75; 116 -10.6,5.25; 117 -10.6,4.75; 118 -10.6,4.25; 119 -10.6,3.75; 120 -10.6,3.25; 121 -10.6,2.75; 122 -10.6,2.25; 123 -10.6,1.75; 124 -10.6,1.25; 125 -10.6,0.75; 126 -10.6,0.25; 127 -10.6,-0.25; 128 -10.6,-0.75; 129 -10.6,-1.25; 130 -10.6,-1.75; 131 -10.6,-2.25; 132 -10.6,-2.75; 133 -10.6,-3.25; 134 -10.6,-3.75; 135 -10.6,-4.25; 136 -10.6,-4.75; 137 -10.6,-5.25; 138 -10.6,-5.75; 139 -10.6,-6.25; 140 -10.6,-6.75; 141 -10.6,-7.25; 142 -10.6,-7.75; 143 -10.6,-8.25; 144 -10.6,-8.75
TSSOP-14 = smd 1.473 x 0.356: 1 -2.921,1.956; 2 -2.921,1.295; 3 -2.921,0.66; 4 -2.921,0; 5 -2.921,-0.66; 6 -2.921,-1.295; 7 -2.921,-1.956; 8 2.921,-1.956; 9 2.921,-1.295; 10 2.921,-0.66; 11 2.921,0; 12 2.921,0.66; 13 2.921,1.295; 14 2.921,1.956
SOT23-3 = smd 0.48 x 0.95: 1 -0.97,-0.98; 2 0.97,-0.98; 3 0,0.98
SOT23-6 = smd 0.6 x 1.1: 1 -0.95,-1.25; 2 0,-1.25; 3 0.95,-1.25; 4 0.95,1.25; 5 0,1.25; 6 -0.95,1.25
IPL1-116-01-XX-D = drill 1.02 square: 1 -19.05,1.27 | drill 1.02: 2 -16.51,1.27; 3 -13.97,1.27; 4 -11.43,1.27; 5 -8.89,1.27; 6 -6.35,1.27; 7 -3.81,1.27; 8 -1.27,1.27; 9 1.27,1.27; 10 3.81,1.27; 11 6.35,1.27; 12 8.89,1.27; 13 11.43,1.27; 14 13.97,1.27; 15 16.51,1.27; 16 19.05,1.27; 17 -19.05,-1.27; 18 -16.51,-1.27; 19 -13.97,-1.27; 20 -11.43,-1.27; 21 -8.89,-1.27; 22 -6.35,-1.27; 23 -3.81,-1.27; 24 -1.27,-1.27; 25 1.27,-1.27; 26 3.81,-1.27; 27 6.35,-1.27; 28 8.89,-1.27; 29 11.43,-1.27; 30 13.97,-1.27; 31 16.51,-1.27; 32 19.05,-1.27
IPL1-115-01-XXX-D-RA = drill 1.016 pad 1.524: 1 -17.78,1.27; 2 -15.24,1.27; 3 -12.7,1.27; 4 -10.16,1.27; 5 -7.62,1.27; 6 -5.08,1.27; 7 -2.54,1.27; 8 0,1.27; 9 2.54,1.27; 10 5.08,1.27; 11 7.62,1.27; 12 10.16,1.27; 13 12.7,1.27; 14 15.24,1.27; 15 17.78,1.27; 16 -17.78,-1.27; 17 -15.24,-1.27; 18 -12.7,-1.27; 19 -10.16,-1.27; 20 -7.62,-1.27; 21 -5.08,-1.27; 22 -2.54,-1.27; 23 0,-1.27; 24 2.54,-1.27; 25 5.08,-1.27; 26 7.62,-1.27; 27 10.16,-1.27; 28 12.7,-1.27; 29 15.24,-1.27; 30 17.78,-1.27
IPL1-102-01-XXX-D-RA = drill 1.016 pad 1.524: 1 -1.27,-9.652; 2 1.27,-9.652; 3 -1.27,-12.192; 4 1.27,-12.192
CONNECTEUR_PROGRAMMEUR = drill 1.03 square: 1 -1.27,2.54 | drill 1.03: 2 1.27,2.54; 3 -1.27,0; 4 1.27,0; 5 -1.27,-2.54; 6 1.27,-2.54
JP4 = drill 0.914 long: 1 -3.81,0; 2 -1.27,0; 3 1.27,0; 4 3.81,0
CSM-3X = smd 3.5 x 1.2: P$1 -2.75,0; P$2 2.75,0

### Placement (x,y rotation side)
C1  32.95,34.6 0 bottom
C2  32.97,37.02 0 bottom
C3  30.44,47.4 0 bottom
C4  36.38,47.53 270 top
C5  36.08,49.3 270 bottom
C6  39.48,49.23 270 bottom
C7  13.81,51.93 270 top
C8  73.77,54.41 90 bottom
C9  59.29,42.52 90 bottom
C10  41.75,4.07 0 top
C11  57.13,16.78 0 top
C12  71.33,16.52 0 top
C13  67.59,5.81 270 top
C14  65.4,5.77 270 top
C15  18,43 0 bottom
C16  18,40.8 0 bottom
C17  18,38.7 0 bottom
C18  18,36.43 0 bottom
C19  18,33.98 0 bottom
C20  18,31.54 0 bottom
C21  18,29.21 0 bottom
C22  18,26.84 0 bottom
C23  18,24.41 0 bottom
C24  18,22.01 0 bottom
C25  17.95,19.54 0 bottom
C26  18,17.13 0 bottom
C27  46.27,34.2 180 bottom
C28  46.58,30.25 180 bottom
C29  31.45,30.9 90 bottom
C31  40.48,22.87 180 bottom
C32  40.16,20.21 270 bottom
C33  36.38,21.47 90 bottom
C34  50,33.5 0 bottom
C35  51.08,30.86 90 bottom
C36  50.21,27.87 0 bottom
C37  57.63,17 0 bottom
C38  58.25,47.75 90 bottom
C39  63.1,41.8 90 bottom
C40  76.29,50.8 180 bottom
C41  76.82,39.71 180 bottom
C42  72.46,35.45 90 bottom
C43  31.86,32.27 0 top
D1  38.64,38.81 90 bottom
D2  26.62,42.57 180 bottom
D3  26.11,40.52 180 bottom
D4  25.85,38.71 180 bottom
D5  25.6,36.43 180 bottom
D6  25.6,33.98 180 bottom
D7  25.6,31.54 180 bottom
D8  25.6,29.32 180 bottom
D9  25.6,26.68 180 bottom
D10  25.6,24.3 180 bottom
D11  25.6,22.05 180 bottom
D12  25.6,19.54 180 bottom
D13  25.6,17.15 180 bottom
D14  33.53,27.94 180 bottom
FB  17.54,43.84 0 top
JP1  74.27,4.83 180 top
L1  39.41,35.93 180 top
LED1  77.34,6.39 270 top
LED2  67.16,46.28 180 top
LED3  67.16,48.27 180 top
LED4  67.16,50.38 180 top
R1  35.55,35.8 90 bottom
R2  30.5,39.73 270 top
R3  31.41,40.15 90 bottom
R4  33.71,45.23 0 bottom
R5  29.14,44.15 90 top
R6  28.1,47.22 180 top
R7  30.92,50.01 270 bottom
R8  31.05,47.66 90 top
R9  25.5,41.48 90 top
R10  18,41.22 0 top
R11  18,38.78 0 top
R12  18,36.43 0 top
R13  18,33.99 0 top
R14  18,31.55 0 top
R15  18,29.19 0 top
R16  18,26.82 0 top
R17  18,24.4 0 top
R18  18,22.02 0 top
R19  18,19.58 0 top
R20  18,17.18 0 top
R21  37.85,18.03 270 bottom
R22  17.22,7.82 90 top
R23  19.39,8.73 90 top
R24  23.44,7.01 0 top
R25  21.68,10.01 90 top
R26  25.98,7.41 270 top
R27  23.82,11.54 90 top
R28  28.09,8.16 270 top
R29  25.92,12.75 90 top
R30  30.37,9.64 270 top
R31  27.99,13.77 90 top
R32  32.45,11.48 270 top
R33  32.33,14.16 0 top
R34  30.55,29.79 180 top
R35  37.87,28.76 270 bottom
R37  47.62,38.75 180 top
R38  77.61,2.81 0 top
R39  15.19,55.02 0 top
R40  74.77,55.21 0 top
R41  77.28,54.41 270 bottom
R42  62.89,46.17 0 top
R43  62.85,48.27 0 top
R44  62.82,50.38 0 top
R45  78.84,33.99 0 top
R46  78.84,31.74 0 top
R47  78.84,29.49 0 top
R48  78.84,26.98 0 top
R49  78.05,17.32 180 top
R50  78.05,19.4 180 top
R51  78.07,21.59 180 top
R52  78.07,23.64 180 top
R53  61.45,50.3 0 bottom
R54  62.47,48.25 0 bottom
R55  65.93,48.21 180 bottom
R56  78.04,37.45 0 bottom
R57  85.85,34.54 0 bottom
R58  85.85,32 0 bottom
R59  85.85,29.46 0 bottom
R60  85.85,26.92 0 bottom
R61  78.49,34.54 0 bottom
R62  78.49,32 0 bottom
R63  78.49,29.46 0 bottom
R64  78.49,26.92 0 bottom
R65  21.59,14.22 0 top
R66  47.24,24.89 270 bottom
R67  42.16,24.64 270 top
R68  45.21,25.15 270 bottom
U1  33.77,43.01 270 top
U2  20.65,52.17 0 top
U3  36.32,23.75 0 top
U4  58.3,48.03 0 top
U5  80.46,44.94 0 top
U6  62.12,30.15 180 top
U7  45.12,10.09 0 top
U8  58.76,6.69 180 top
U9  70.84,11.1 0 top
U10  14.93,54.29 90 bottom
U11  88.9,30.73 0 top
U$1  [LOGO_HV]  22.61,18.8 0 top
U$2  [LOGO_ERACING]  82.33,24.63 90 top
U$3  [LOGO_OPEN_HARDWARE]  90.93,36.32 90 top
X1  11,23.7 90 top
X2  3.34,24.96 90 top
X3  -0.93,55 90 top
X4  93.2,55 270 top
X5  47.35,48.02 270 top
X6  82.34,30.74 270 top
Y1  46.59,32.09 90 top

### Tracks (layer width: path | path; a pad name or v marks a point on that pad's centre or on a via)
1  (via drill 0.6)
  Top 0.254: U1.8 33.77,39.49 v34.87,38.98
  Bottom 0.406: R1.2 C2.1 v34.87,38.98
5V_BUS  (via drill 0.6)
  Top 0.406: X3.1 8.72,53.26 9.4,52.32 13.1,52.32 C7.1 13.81,53.98 R39.1 | v73.95,50.8 75.37,49.38 U5.8 78.54,47.24 85.09,47.24 85.85,48.01 85.85,53.96 X4.1
  Top 1: X4.1 83.55,57.72 82.84,58.42 7.62,58.42 6.35,57.4 6.35,54.61 7.11,53.85 8.6,53.85 X3.1
  Bottom 0.406: C40.1 v73.95,50.8
/SS1  (via drill 0.4)
  Top 0.254: U6.61 46.4,26.9 v44.23,27.76 43.98,28.02 42,29 U3.CSBI
  Bottom 0.305: R66.1 47.24,26.42 46.23,27.43 44.82,27.43 v44.23,27.76
AN00
  Top 0.254: U7.1 45.84,14 60.99,14 61.37,14.38 U6.89
  Top 0.305: U7.2 U7.1
AN01
  Top 0.254: U7.9 46.66,8.8 46.66,12.8 61.31,12.8 62.37,13.85 U6.91
  Top 0.305: U7.9 U7.8
AN02
  Top 0.254: U8.8 | U8.8 U8.9 | U8.8 58.7,11.5 61.54,11.5 63.37,13.33 U6.93
AN03
  Top 0.254: U8.1 U8.2 60.9,5.39 59.94,6.35 59.94,9.4 60.96,10.41 61.98,10.41 64.37,12.8 U6.95
AN04
  Top 0.254: U6.97 65.37,15.61 U9.1
  Top 0.305: U9.2 U9.1
AN05
  Top 0.254: U9.6 69.85,9.81 70.36,10.32 70.36,12.19 66.37,16.18 U6.99
  Top 0.305: U9.7 U9.6
AN06
  Top 0.254: U6.101 67.37,16.45 71.12,12.7 71.12,10.67 71.98,9.81 U9.9
  Top 0.305: U9.8 U9.9
AN07
  Top 0.254: U9.14 71.95,13.06 68.37,16.64 U6.103
  Top 0.305: U9.13 U9.14
AN08
  Top 0.254: U7.6 43.36,8.8 46.36,13.35 61.1,13.35 61.87,14.12 U6.90
  Top 0.305: U7.6 U7.7
AN09
  Top 0.254: U6.92 62.87,13.59 61.32,12.05 U7.14
  Top 0.305: U7.13 U7.14
AN10
  Top 0.254: U8.13 U8.14 58.07,4.73 59.18,6.1 59.18,9.4 60.64,10.98 61.65,10.98 63.87,13.07 U6.94
AN11
  Top 0.254: U8.6 U8.7 64.87,11.83 U6.96
BKGD
  Top 0.305: X5.1 55.49,43.69 58.04,43.69 58.87,42.86 U6.25
C1  (via drill 0.6)
  Top 0.254: U3.C1 40.69,19 41.15,18.54 41.15,18.03 40.64,17.53 20.57,17.53 20.25,17.2 v20.25,17.15
  Top 0.813: R20.2 20.13,17.18 v20.25,17.15
  Bottom 0.61: D12.A D13.C v20.25,17.15
  Bottom 0.813: C26.1 v20.25,17.15
C2  (via drill 0.6)
  Top 0.254: v20.1,19.54 20.66,18.49 U3.C2
  Top 0.813: R19.2 19.95,19.58 v20.1,19.54
  Bottom 0.61: D11.A D12.C
  Bottom 0.813: C25.1 v20.1,19.54 D12.C
C3  (via drill 0.6)
  Top 0.254: v20.25,22.01 arc-90 20.28,22.05 20.7,22.05 21.61,19.49 U3.C3
  Top 0.813: R18.2 v20.24,22.02 v20.25,22.01
  Bottom 0.61: D10.A D11.C
  Bottom 0.813: D11.C 20.28,22.05 v20.25,22.01 C24.1
C4  (via drill 0.6)
  Top 0.254: v20.25,24.41 20.97,24.41 22.35,20.49 U3.C4
  Top 0.813: R17.2 20.23,24.4 v20.25,24.41
  Bottom 0.61: D9.A D10.C
  Bottom 0.813: D10.C 20.36,24.3 v20.25,24.41 C23.1
C5  (via drill 0.6)
  Top 0.254: v20.25,26.84 21.24,26.84 23.1,21.49 U3.C5
  Top 0.813: R16.2 20.23,26.82 v20.25,26.84
  Bottom 0.61: D8.A D9.C
  Bottom 0.813: D9.C 20.4,26.68 v20.25,26.84 C22.1
C6  (via drill 0.6)
  Top 0.254: v20.25,29.21 21.4,29.21 23.86,22.49 U3.C6
  Top 0.813: R15.2 20.22,29.19 v20.25,29.21
  Bottom 0.61: D7.A D8.C | C21.1 v20.25,29.21
  Bottom 0.813: D8.C 20.35,29.32 v20.25,29.21
C7  (via drill 0.6)
  Top 0.254: v20.25,31.55 21.55,31.54 24.64,23.49 U3.C7
  Top 0.813: R14.2 v20.25,31.55
  Bottom 0.61: D6.A D7.C
  Bottom 0.813: C20.1 v20.25,31.55 D7.C
C8  (via drill 0.6)
  Top 0.254: v20.25,33.98 21.65,33.98 25.55,24.49 U3.C8
  Top 0.813: R13.2 20.24,33.99 v20.25,33.98
  Bottom 0.61: D5.A D6.C
  Bottom 0.813: C19.1 v20.25,33.98 D6.C
C9  (via drill 0.6)
  Top 0.254: v20.25,36.43 21.73,36.43 26.33,25.49 U3.C9
  Top 0.61: R12.2 v20.25,36.43
  Bottom 0.61: D4.A D5.C v20.25,36.43
  Bottom 0.813: R12.2 v20.25,36.43
C10  (via drill 0.6)
  Top 0.254: v20.25,38.71 21.87,38.71 27.1,26.49 U3.C10
  Top 0.813: R11.2 20.18,38.78 v20.25,38.71
  Bottom 0.61: D3.A D4.C v20.25,38.71 C17.1
C11  (via drill 0.6)
  Top 0.254: v20.25,41.22 21.84,41.22 27.81,27.49 U3.C11
  Top 0.813: R10.2 v20.25,41.22
  Bottom 0.61: D2.A D3.C
  Bottom 0.813: C16.1 20.18,41.15 v20.25,41.22 21.32,40.52 D3.C
C12  (via drill 0.6)
  Top 0.254: v23,42.32 28.57,28.49 U3.C12
  Top 0.406: v23,42.32 R9.2
  Bottom 0.813: C15.1 19.27,43 v23,42.32 D2.C
C44  (via drill 0.5 pad 1.02)
  Top 0.254: 34.77,40.82 U1.10 34.92,40.82 34.92,40.69 | v36.38,45.09
  Top 0.406: C4.2 v36.38,45.09
  Top 0.61: v36.38,40.69 34.92,40.69
  Top 0.813: L1.P$2 36.82,38.4 36.63,38.87 v36.38,40.69
  Bottom 0.406: v36.38,45.09 v36.38,40.69
  Bottom 0.61: D1.C 36.38,38.25 v36.38,40.69
CAN_H  (via drill 0.6)
  Top 0.406: v17.53,56.13 18.29,56.64 73.92,56.64 | 73.92,56.64 77.22,56.64 | 77.22,56.64 78.02,56.64 80.93,53.73 X4.4 | R40.1 73.92,56.64 | U5.7 79.19,53.14 77.47,54.86 77.47,56.39 77.22,56.64
  Bottom 0.406: X3.4 13.57,56.27 U10.2 15.74,56.13 v17.53,56.13
CAN_L
  Top 0.305: U5.6 81.72,52.23 82.27,53.02 82.27,55.25 X4.3
  Top 0.406: X4.3 79.66,56.27 78.53,57.4 14.68,57.4 X3.3
  Bottom 0.406: X3.3 11.65,53.34 U10.1 | 77.42,55.12 R41.1 78.29,56.27 X4.3
CSS  (via drill 0.4)
  Top 0.254: U1.4 33.26,46.46 v32.76,46.96
  Bottom 0.254: v32.76,46.96 C3.1
EXTAL  (via drill 0.6)
  Top 0.305: Y1.P$2 47.95,31.32 47.95,29.77 49.32,28.4 U6.58
  Top 0.61: v45.14,36.32 Y1.P$2
  Bottom 0.61: C27.1 v45.14,36.32
GND  (via drill 0.4, 0.5, 0.5 pad 1.02, 0.6, 0.8, 0.9)
  Top 0.254: U1.9 34.27,43.01 U1.11 | U8.11 57.95,6.69 v57.95,6.5 | C10.2 43.38,4.02 v43.99,3.76 | U6.81 57.37,23 v57.09,23 | U4.4 56.69,47.08 | U3.A3 U3.A2 U3.A1 U3.A0 38.64,25.5 v38.1,24.38 38.79,23.5 U3.TOS | U3.C0 41.91,20 v42.42,19.56
  Top 0.305: U6.52 53.69,31.4 53.69,31.6 | U6.60 53.93,27.4 | U6.57 53.49,28.9 53.69,29.1 | U6.27 57.87,38.78 57.69,38.6 | U6.16 63.37,38.78 63.19,38.6 | 70.69,22.1 70.89,21.9 U6.110 U6.109 | U6.88 60.87,21.42 60.69,21.6 | U6.138 70.09,35.9 70.09,36 | U7.11 51.16,10.09 v51.16,9 | U6.81 57.37,18.37 C11.1 | U9.11 v72.19,11.1 | 56.69,47.08 v56.69,46.33
  Top 0.406: 78.9,19.52 R50.1 | 78.9,21.7 R51.1 | 78.92,23.39 R52.1 | X2.18 5.07,12.21 | R5.1 30.75,43.3 v31.22,43.09 | C12.2 72.19,16.51 v73.53,16.51 | R38.1 76.02,3.56 JP1.2 | U5.4 v84.26,38.35 | U11.2 v88.9,30.73 U11.5 | 7.11,12.19 7.1,12.19 7.1,12.23
  Top 0.61: 78.9,19.52 R49.1 78.87,17.29 v78.87,15.49 | R50.1 78.9,21.7 | R51.1 78.92,23.39 | 9.82,12.32 9.82,12.26 9.82,12.18 | C43.C v30.1,32.96 | 65.44,4.96 C14.2 66.55,4.92 | 66.55,4.92 67.56,4.92 C13.2 | v66.5,3.62 66.5,4.88 66.55,4.92
  Top 1.27: 9.82,12.26 X1.20 15.53,12.27 v17.64,14.76 | 4.6,12.2 5.07,12.21 7.1,12.23 | 7.1,12.23 X1.4 | 9.82,12.18 7.1,12.23 | v17.78,2.29 9.72,2.29 X1.1 7.11,5.59 7.11,12.19
  Bottom 0.61: 26.16,4.83 18.54,4.83 v17.78,2.29
  Bottom 0.813: C5.2 C6.2 | 17,16.76 17,17.02 | 17,17.02 17,43.18 | C26.2 17,17.02
  other vias: 38.98,45.09 38.98,43.49 68.09,27 66.58,35.47 40.75,45.09 42.21,45.07 60.23,37.25 41.52,42.09
  pour Top: 53.19,39.1 71.19,39.1 71.19,21.1 53.19,21.1
  pour Top (no thermals): 30.22,42.1 38.1,42.1 38.1,40.76 43.02,40.76 43.02,46.03 37.98,46.03 37.98,43.89 30.22,43.89
  pour Bottom: 23.49,53.5 23.49,45.48 -2.3,45.48 -2.3,-1.85 94,-1.85 93.75,42.95 69.5,42.95 69.5,53.5
GND_BUS  (via drill 0.6)
  Top 0.406: v17.53,52.32 17.51,52.05 U2.3 17.5,51.08 C7.2 | U5.5 84.31,52.91 X4.2
  Bottom 0.406: v17.53,52.32 17.78,52.32
  pour Bottom: -1,51 19.77,51 19.77,56.75 72.94,57 72.94,47.21 92,47.21 92,64 -1,64
MISO1  (via drill 0.4, 0.4 pad 0.2)
  Top 0.254: U6.64 45.01,25.4 v43.72,25.15 | U3.SDO 38.66,28.5 38.1,28.19 38.1,26.86 v38.13,26.76
  Bottom 0.254: v43.72,25.15 43.1,25.92 39.46,26.02 v38.13,26.76
  Bottom 0.305: R35.2 v38.13,26.76
MOSI1
  Top 0.254: U6.63 42.78,25.9 42.72,25.96 | U3.SDI 41.6,28 42.16,27.43 42.16,26.52 42.72,25.96 | R67.1 42.63,25.96 42.72,25.96
N$1  (via drill 0.5)  (1 unrouted)
  Top 0.254: 32.96,28.99 v32.96,30.12
  Top 0.406: R34.1 32.38,29.79 v32.96,30.12
  Bottom 0.305: C29.1 v32.96,30.12
N$2
  Top 0.406: R39.2 16.84,54.26 U2.1
N$3  (via drill 0.6)
  Top 0.305: U6.87 60.37,17.28 v60.09,17
  Bottom 0.61: v60.09,17 C37.1
N$4  (via drill 0.5)
  Top 0.254: v38.1,22.61 38.52,22.5 U3.VREF
  Bottom 0.406: C31.1 38.37,22.87 v38.1,22.61 37.81,22.32 C33.2
N$5  (via drill 0.4, 0.5)
  Top 0.254: U3.VREG 40.64,23 40.82,23
  Top 0.305: 40.82,23 41.53,21.97 v41.53,21.08 | 40.64,23 41.43,23.79 R67.2 43.6,23.79 v43.69,23.88
  Bottom 0.305: v43.69,23.88 44.54,23.88 R68.2 45.47,24.04 R66.2
  Bottom 0.406: v41.53,21.08 41.63,21.06 C32.1 37.08,21.06 C33.1
N$6  (via drill 0.5)  (1 unrouted)
  Top 0.254: U3.V- 38.47,20.5 v38.1,20.07
  Bottom 0.406: v38.1,20.07 37.82,19.81 R21.1
N$7  (via drill 0.3)
  Top 0.305: U6.55 U6.56 50.06,29.39 49.83,29.27 v49.61,29.27
  Bottom 0.305: v49.61,29.27 C36.2
N$11
  Top 0.254: U4.2 58.32,48.28 58.32,46.27 59.13,45.47 61.31,45.47 R42.1
N$16
  Top 0.254: 77.09,17.29 77.06,17.32 R49.2 74.55,19.97 74.55,25.65 73.8,26.4 U6.119
N$17
  Top 0.254: 77.06,19.3 R50.2 76.74,19.4 75.06,21.08 75.06,26.16 74.32,26.9 U6.120
N$19
  Top 0.254: 77.22,21.51 R51.2 76.33,21.59 75.56,22.35 75.56,26.42 74.58,27.4 U6.121
N$20
  Top 0.254: 77.18,23.63 R52.2 77.2,23.62 76.83,23.62 76.07,24.38 76.07,26.67 74.84,27.9 U6.122
N$23
  Top 0.61: R42.2 65.73,46.17 LED2.C
N$25
  Top 0.61: R43.2 LED3.C
N$26
  Top 0.61: R44.2 LED4.C
N$27
  Top 0.254: R44.1 61.42,50.32 60.66,48.28 U4.7
N$28
  Top 0.254: R43.1 60.87,47.26 U4.5
N$30  (via drill 0.5, 0.5 pad 1.02)
  Top 0.305: v49.41,21.76 50.34,24.4 U6.66 | X1.17 14.99,7.37 14.99,9.91 19.3,14.22 R65.1 20.74,14.64 22.35,16.26 42.04,16.26 45.35,18.56 v46.39,18.56
  Bottom 0.305: v46.39,18.56 v49.41,21.76
N$31
  Top 0.254: U6.131 76.66,32.4 R45.1
  Top 0.305: 78.09,33.99 77.84,33.59 R45.1
N$32  (via drill 0.6)
  Top 0.406: R40.2 v75.61,53.34
  Bottom 0.406: C8.1 73.99,53.34 v75.61,53.34 77.06,53.34 R41.2
N$33
  Top 0.254: U6.130 77.83,31.9 R46.1
  Top 0.305: 77.6,32 77.85,32 R46.1
N$34  (via drill 0.4)
  Top 0.254: U4.6 58.75,47.77 58.75,46.64 v60.08,46.4 | U6.8 67.37,43 v67.12,43.69
  Bottom 0.305: R54.2 60.94,47.41 v60.08,46.4 63.88,46.4 65.41,43.69 v67.12,43.69
N$35  (via drill 0.4)
  Top 0.254: U4.3 57.85,47.77 57.85,45.97 59.05,44.7 64.9,44.7 | v66.04,44.7 64.9,44.7 | U6.9 66.87,42.23 64.9,44.7
  Bottom 0.305: R55.2 66.84,46.23 v66.04,44.7
N$40  (via drill 0.4)
  Top 0.254: U4.1 55.69,48.79 v55.69,49.02 55.5,48.95 55.5,45.72 57.02,44.2 64.64,44.2 66.37,41.96 U6.10
  Bottom 0.254: 55.75,49.02 v55.69,49.02
  Bottom 0.305: R53.2 60.35,50.8 57.28,50.8 55.75,49.02
N$42
  Top 0.254: U1.1 34.76,47.49 C4.1
N$43  (via drill 0.5)
  Top 0.254: U1.5 v31.11,45.21
  Bottom 0.254: v31.11,45.21 R4.2
N$44
  Top 0.254: U6.129 76.59,31.4 R47.1
N$45  (via drill 0.6)
  Top 0.254: v33.26,38.66 33.27,39.49 U1.7
  Top 0.406: R2.1 v33.26,38.66
  Bottom 0.406: R3.2 33.28,39.73 v33.26,38.66
N$47
  Top 0.406: LED1.C 78.46,3.75 R38.2
N$48
  Top 0.254: U6.128 75.85,30.9 R48.1
N$49  (via drill 0.6)
  Top 0.254: U1.3
  Top 0.305: U1.3 33.77,47.39 33.15,47.88 32.24,47.88 R8.1
  Top 0.406: R5.2 31.02,46.52 R8.1
  Top 0.61: R5.2 28.36,45 v27.88,45.78 | v26.29,49.02 24.71,51.11 U2.4
  Bottom 0.61: v27.88,45.78 27.3,47.5 v26.29,49.02
N$50  (via drill 0.6)
  Top 0.305: R8.2 R6.1
  Top 0.406: R6.1 28.95,48.76 v28.96,48.96
  Top 0.61: U2.6 25.84,52.96 27.57,51.05 v29.08,51.05
  Bottom 0.406: v28.96,48.96 28.96,50.67 v29.08,51.05
  Bottom 0.61: R7.2 29.35,49.16 v28.96,48.96
N$51
  Top 0.406: R45.2 81.01,34.55 X6.1 81.79,34.55 81.79,34.54 88.39,34.54 89.85,33.34 U11.4
  Bottom 0.406: R61.1 X6.1 R57.2
N$52
  Top 0.406: R46.2 79.46,32.01 X6.2 87.95,32.01 U11.6
  Bottom 0.406: R62.1 X6.2 R58.2
N$53
  Top 0.406: R47.2 79.71,29.47 X6.3 87.7,29.47 U11.1
  Bottom 0.406: R63.1 X6.3 R59.2
N$54
  Top 0.406: R48.2 79.5,26.93 X6.4 88.65,26.92 89.85,28.13 U11.3
  Bottom 0.406: R64.1 X6.4 R60.2
R59
  Bottom 0.406: R1.1 C1.1
RST  (via drill 0.3)
  Top 0.254: v49.6,30.37 50.38,30.4 U6.54
  Top 0.305: v49.6,30.37 48.64,31.24 48.64,38.5 R37.1 48.47,45.25 X5.4
  Bottom 0.254: C35.1 49.72,30.34 v49.6,30.37
RXCAN_SLV
  Top 0.305: U6.135 74.66,34.4 79.19,38.94 U5.2
S1
  Top 0.254: X1.21 13.98,14.8 14.98,16 20.83,16 21.98,17 40.88,17 41.66,17.78 41.66,18.8 40.95,19.5 U3.S1
S2
  Top 0.254: X1.22 12.32,17.3 13.28,17.3 14.62,18.4 19.48,18.4 19.89,17.99 33.99,17.99 34.5,18.5 U3.S2
S3
  Top 0.254: X1.23 13.49,19.9 14.22,20.8 20.6,20.8 21.27,18.99 U3.S3
S4
  Top 0.254: X1.24 12.3,22.4 12.63,22.4 13.98,23.2 20.82,23.2 22,19.99 U3.S4
S5
  Top 0.254: X1.25 12.3,25 12.32,25 13.17,25.6 21.13,25.6 22.75,20.99 U3.S5
S6
  Top 0.254: X1.26 13.01,28 21.34,28 23.48,21.99 U3.S6
S7
  Top 0.254: 12.4,30 12.53,30 13.08,30.4 21.48,30.4 24.25,22.99 U3.S7
  Top 0.406: 12.4,30 12.27,30 X1.27
S8
  Top 0.254: X1.28 12.48,32.8 21.59,32.8 25.06,23.99 U3.S8
S9
  Top 0.254: X1.29 12.34,35.2 21.71,35.2 25.95,24.99 U3.S9
S10
  Top 0.254: X1.30 12.34,37.6 21.83,37.6 26.71,25.99 U3.S10
S11
  Top 0.254: X1.31 12.48,40 21.83,40 27.47,26.99 U3.S11
S12
  Top 0.254: X1.32 12.62,42.4 21.97,42.4 28.19,27.99 U3.S12
SCK1  (via drill 0.4)
  Top 0.254: U6.62 45.05,26.4 44.02,26.67 v43.69,26.67 | U3.SCKI 40.64,27.5 v41.15,26.92
  Bottom 0.254: v41.15,26.92 v43.69,26.67
  Bottom 0.305: R68.1 44.62,26.25 v43.69,26.67
T0  (via drill 0.25)
  Top 0.305: v37.46,4.25 37.46,10.75 U7.3
  Top 0.406: R22.1 17.22,5.73 v17.25,5.7
  Bottom 0.254: v37.46,4.25 36.09,5.64 v17.25,5.7 16.51,5.08 16.49,2.24 15.25,1.25 6.75,1.25 5.25,2.25 5.25,4.25 3.31,6.5 3.31,13.5 X2.4
T1  (via drill 0.25)
  Top 0.305: v39.71,4.99 39.71,9.43 U7.5
  Top 0.406: R23.1 19.39,6.57 v19.43,6.53
  Bottom 0.254: v39.71,4.99 38.34,6.52 v19.43,6.53 16.98,6.52 15.99,5.5 15.99,2.49 15,1.75 7,1.75 5.94,2.5 5.94,15.5 5.5,16 3.5,16 X2.5
T2  (via drill 0.25)
  Top 0.305: U7.10 49.86,9.43 49.86,7.2 41.71,7.2 v41.71,5.75
  Top 0.406: R24.1 21.26,7.01 v20.74,7.27
  Bottom 0.254: v41.71,5.75 40.21,7.27 v20.74,7.27 17.01,7.27 15.49,5.75 15.49,3.25 14.5,2.25 7.25,2.25 6.44,2.75 6.44,17.5 5.5,18.5 3.5,18.5 X2.6
T3  (via drill 0.25)
  Top 0.305: U7.12 52.36,10.75 52.36,6.6 43.46,6.6 v42.96,6.5
  Top 0.406: R25.1 21.68,8.57 v21.73,8.02
  Bottom 0.254: v42.96,6.5 42.24,6.5 40.56,8.02 v21.73,8.02 16.75,8.02 14.74,5.75 14.74,3.49 14,2.75 7.75,2.75 6.94,3.25 6.94,19.75 5.5,21.25 3.25,21.25 X2.7
T4  (via drill 0.25)
  Top 0.305: U8.10 53.84,7.35 v53.21,4.76
  Top 0.406: R26.1 23.98,8.26 v23.47,8.77
  Bottom 0.254: v53.21,4.76 45.98,4.75 41.92,8.77 24.93,8.77 v23.47,8.77 22.97,8.77 16.5,8.77 13.98,5.99 13.98,3.74 13.5,3.25 8.25,3.25 7.44,3.75 7.44,21.5 5.5,23.75 3.5,23.75 X2.8
T5  (via drill 0.25)
  Top 0.305: U8.12 54.33,6.03 v54.21,5.51
  Top 0.406: R27.1 23.82,9.9 v24.2,9.52
  Bottom 0.254: v54.21,5.51 45.97,5.5 42.16,9.27 24.7,9.27 v24.2,9.52 23.2,9.52 16.25,9.52 12.99,6 9,6 7.94,7 7.94,23.75 5.5,26.25 3.5,26.25 X2.9
T6  (via drill 0.25)
  Top 0.305: U8.3 62.87,6.03 v63.5,5.15
  Top 0.406: R28.1 v25.44,10.02
  Bottom 0.254: 42.73,9.92 25.79,9.92 v25.44,10.02 24.94,10.27 14.99,10.27 13.48,8.5 9,8.5 8.44,9 8.44,25.5 5.5,28.75 3.25,28.75 X2.10
  Bottom 0.305: v63.5,5.15 55.81,5.15 54.56,6.65 48.9,6.65 46.99,8.89 43.57,8.89 42.73,9.92
T7  (via drill 0.25)
  Top 0.305: U8.5 62.65,7.33 v63.42,7.8
  Top 0.406: R29.1 25.92,11.02 v26.17,10.77
  Bottom 0.254: 43.95,9.51 43.11,10.52 26.73,10.53 v26.17,10.77 v26.18,10.77 25.7,10.94 11.5,10.94 11,11.5 11,25.5 10.25,26.25 9,26.25 8.5,26.75 8.5,29.5 6.75,31.25 3.25,31.25 X2.11
  Bottom 0.305: v63.42,7.8 52.96,7.8 51.96,7.35 49.25,7.35 47.22,9.51 43.95,9.51
T8  (via drill 0.25)
  Top 0.254: U9.3 66.01,11.76 v65,10.38
  Top 0.406: R30.1 28.45,10.49 v27.66,11.27
  Bottom 0.254: v65,10.38 64.87,10.26 64.77,10.2 44.17,10.2 43.42,11.02 28.42,11.02 v27.66,11.27 26.91,11.52 16.26,11.52 13.75,13.53 13.75,25.25 12.75,26.25 11.5,26.25 11,26.75 11,30.5 10.25,31.25 9,31.25 7,34 3.5,34 X2.12
T9  (via drill 0.25)
  Top 0.254: U9.5 69.59,10.44 v69.59,11.08
  Top 0.406: R31.1 27.99,12.43 v28.65,11.77
  Bottom 0.254: v69.59,11.08 68.71,11.56 63.36,11.58 61.63,10.8 44.68,10.8 43.93,11.77 v28.65,11.77 27.9,12.02 16.5,12.02 14.25,13.77 14.25,25.75 13.75,26.25 13.75,30.5 13,31.25 11.75,31.25 11,32 11,33 10,34 8.5,34 6.5,36.5 3,36.5 X2.13
T10  (via drill 0.25)
  Top 0.254: U9.10 74.71,10.44 v75.23,10.48
  Top 0.406: R32.1 29.82,12.33 v29.63,12.52
  Bottom 0.254: v75.23,10.48 73.31,12.25 68.51,12.28 63.26,12.28 61.54,11.4 45.27,11.4 44.39,12.51 v29.63,12.52 16.75,12.52 14.75,14.02 14.75,26 14.25,26.5 14.25,30.75 13.5,31.5 13.5,33.25 13,33.75 11.75,33.75 11,34.5 11,35.75 10.25,36.5 8.5,36.5 6,39 3.25,39 X2.14
T11  (via drill 0.25)
  Top 0.254: U9.12 75.05,11.76 v75.43,11.96
  Top 0.406: R33.1 31,14.16 v30.36,13.27
  Bottom 0.254: v75.43,11.96 74.17,12.95 62.91,12.98 60.94,12 45.72,12.19 44.96,13.27 v30.36,13.27 16.62,13.27 15.25,14.26 15.25,30.75 14.5,31.5 14.5,33.5 13.75,34.25 13.75,38.25 13.01,39 9,39 6.5,41.5 3.5,41.5 X2.15
TXCAN_SLV  (via drill 0.6)
  Top 0.305: U6.134 75.56,33.9 81.73,40.08 | v81.72,38.54 81.73,38.55 81.73,40.08 | 81.73,40.08 U5.3
  Bottom 0.305: R56.1 79.98,38.54 v81.72,38.54
V1
  Top 0.406: 10,14.64 10,14.73 10,14.8 | 10,14.8 10.9,16.09 13.52,16.09 14.82,17.2 17.13,17.2 R20.1 | X1.5 10,14.81 10,14.8
  Top 1.27: X2.19 X1.5
V2
  Top 0.406: X1.6 10.98,18.6 13.34,18.6 14.48,19.6 17.13,19.6 R19.1
  Top 1.27: X2.20 X1.6
V3
  Top 0.406: X1.7 10.94,21.16 12.78,21.16 13.7,22.02 R18.1
  Top 1.27: X2.21 X1.7
V4
  Top 0.406: R17.1 13.93,24.4 12.9,23.66 10.96,23.66 X1.8
  Top 1.27: X2.22 X1.8
V5
  Top 0.406: X1.9 10.99,26.23 13.02,26.23 13.61,26.82 R16.1
  Top 1.27: X2.23 X1.9
V6
  Top 0.406: R15.1 14.8,29.2 13.45,29.2 12.95,28.77 10.92,28.77 X1.10
  Top 1.27: X2.24 X1.10
V7
  Top 0.406: X1.11 10.99,31.3 13.27,31.3 13.52,31.55 R14.1
  Top 1.27: X2.25 X1.11
V8
  Top 0.406: R13.1 17.22,33.86 10.94,33.86 X1.12
  Top 1.27: X2.26 X1.12
V9
  Top 0.406: R12.1 16.85,36.43 11.03,36.43 X1.13
  Top 1.27: X2.27 X1.13
V10
  Top 0.406: R11.1 16.85,38.93 10.86,38.93 X1.14
  Top 1.27: X2.28 X1.14
V11
  Top 0.406: R10.1 17.1,41.53 10.92,41.53 X1.15
  Top 1.27: X2.29 X1.15
V12
  Top 0.813: FB.1 14.32,43.84 13.46,44.7 11.18,44.7 X1.16
  Top 1.27: X2.30 X1.16
V12_FERRITE  (via drill 0.5, 0.6)
  Top 0.254: U1.2 34.27,48.32 v33.52,49.65
  Top 0.406: 27.22,40.72 28.96,29.79 R34.2 29.72,29.79 v29.72,31.5 | R9.1 27.22,40.63 27.22,40.72 | 27.22,40.72 26.67,43.84
  Top 0.61: v33.52,49.65 33.27,49.97 27.5,49.97 R6.2 26.67,46.2 26.67,43.84 FB.2
  Bottom 0.406: v29.72,31.5 29.72,28.78 D14.C
  Bottom 0.61: 39.27,50.38 C6.1
  Bottom 0.813: 39.27,50.38 C5.1 v33.52,49.65
VCC  (via drill 0.4, 0.6, 0.7, 1.2)
  Top 0.254: 74.55,29.78 v74.55,29.72 | v59.04,49.79 59.04,49.54 59.04,50.04
  Top 0.305: U6.82 57.87,16.78 C11.2 | U8.4 61.71,6.69 | U6.107 U6.108 | U6.53 50.34,30.9 v49.58,31.63 | 38.61,4.06 38.61,10.09 U7.4 | 38.61,4.06 C10.1 | U6.139 74.5,36.4 v75.08,36.72 76.65,38.3 U5.1 | U6.127 74.19,30.4 74.55,29.78 | v57.28,42.67 58.37,42.09 U6.26 | U4.8 59.03,48.79 v59.04,49.79 59.04,50.04 | 67.34,6.53 C13.1 66.42,7.83 66.42,11.1 U9.4 | 38.61,4.06 38.61,2.03
  Top 0.406: v73.03,19.55 U6.108 70.87,17.41 C12.1 | C14.1 65.4,6.66 | JP1.1 74.55,6.38 LED1.A | v57.28,42.67 v50.16,42.67 | U8.4 65.4,6.69 C14.1 | C14.1 67.59,6.62 C13.1 | R37.2 44.81,38.75 44.81,39 | R65.2 23.82,12.84 R27.2
  Top 0.61: LED2.A LED3.A LED4.A 67.39,52.07 v62.36,52.07 59.05,52.07 | v49.33,18.63 52.34,15.25 57.34,15.25 57.48,15.39 C11.2 | R2.2 C43.A | v37.97,30.99 37.97,31.5 | v43.79,32.19 41.18,32.19 41.12,31.5 | 59.04,50.04 59.05,52.07 | 59.05,52.07 43.81,52.07 42.8,51.05 42.8,48.51 44.56,46.75 X5.6 | C13.1 70.77,6.66 71.58,5.85 | R22.2 18.13,9.58 R23.2 20.68,10.86 R25.2 23.2,12.39 R27.2 25.04,13.6 R29.2 26.94,14.62 R31.2 28.86,15.49 33.18,15.49 R33.2 34.04,13.56 34.04,12.19 | R24.2 24.9,6.56 R26.2 26.83,6.56 R28.2 28.89,7.31 R30.2 30.61,8.79 R32.2 32.98,10.63 34.04,11.68 34.04,12.19 | 35.56,12.19 34.04,12.19 | 68.58,46.23 68.58,43.94 70.1,42.67 73.15,42.67 74.99,40.64 74.99,37.15 v75.08,36.72
  Top 0.813: C43.A 32.89,36.77 34.49,31.5 37.97,31.5 41.12,31.5 41.12,35.81 L1.P$1
  Top 1.27: X5.6 44.81,39 41.12,35.81 | v49.33,18.63 46.71,15.49 44.58,15.49 35.56,12.19 35.56,2.79 37.08,2.03 38.61,2.03 70.83,2.03 71.58,5.85 71.63,6.1 73,6.1 JP1.1
  Bottom 0.254: v74.55,29.72 75.08,29.44
  Bottom 0.305: C34.2 49.59,32.4 v49.58,31.63 | C9.2 57.98,43.37 v57.28,42.67 | C38.2 59.04,48.91 v59.04,49.79
  Bottom 0.406: R35.1 v37.97,30.99 | v73.03,19.55 73.29,20.32 73.73,20.32 | C42.2 74.65,36.3 v75.08,36.72 75.97,37.61 | C41.1 75.97,37.61 | R56.2 76.13,37.45 75.97,37.61 | R61.2 75.08,34.54 | R62.2 75.08,32 | R63.2 77.61,29.44 75.08,29.44 | R64.2 75.08,26.92 75.08,26.67
  Bottom 0.61: R55.1 R54.1 R53.1 v62.36,52.07 | v49.58,31.63 47.7,32.02 44.32,32.02 v43.79,32.19 | v50.16,42.67 48.64,41.15 48.64,40.81
  Bottom 1.93: X5.6 44.81,43.71 48.64,40.81 54.23,36.58 54.23,19.94 53.95,19.66
  Bottom 2.184: v75.08,36.72 75.08,34.54 75.08,32 75.08,29.44 75.08,26.67 75.08,22.8 73.09,19.55 v73.03,19.55 54.34,19.68 53.95,19.66 50.55,19.55 v49.33,18.63
VDD1  (via drill 0.4)
  Top 0.305: U6.15 63.87,42.25 v61.41,43.12
  Bottom 0.305: v61.41,43.12 62.06,43.12 C39.2
XTAL  (via drill 0.6)
  Top 0.305: U6.59 48.32,27.9 46.79,29.59 Y1.P$1
  Top 0.61: v43.49,30.23 46.79,29.59
  Bottom 0.61: C28.1 v43.49,30.23

### Text on the board
tPlace: 5V_CAN | CAN_L | LOW VOLTAGE | CAN_H | HIGH VOLTAGE | CAN | CAN | PROG | EN | GND | RXCAN | TXCAN | TVS | !SS | General I/O | MOSI | SCK | MISO | 8 | 4 | 2 | 1 | VCC | ID resistors | GND | T11 | (AOP) | (AOP) | PWR | (AOP) | T1 | VCC | T0 | BMSafe Slave BMS v2.0 | GND | VTIM | DISCH. | GND | Gracieuseté de Labo Circuits
bPlace: GND_CAN | 5V_CAN | TVS | LOW VOLTAGE | 5V_CAN | GND_CAN | HIGH VOLTAGE | VCC | VCC | Pull-Up: | Pull-Down: | T11 | T8 | T10 | T7 | T9 | T5 | T6 | T4 | T3 | T2 | T1 | VCC | T0 | GND